# Altium project LockSafe.PrjPcb (part 1 of 2)
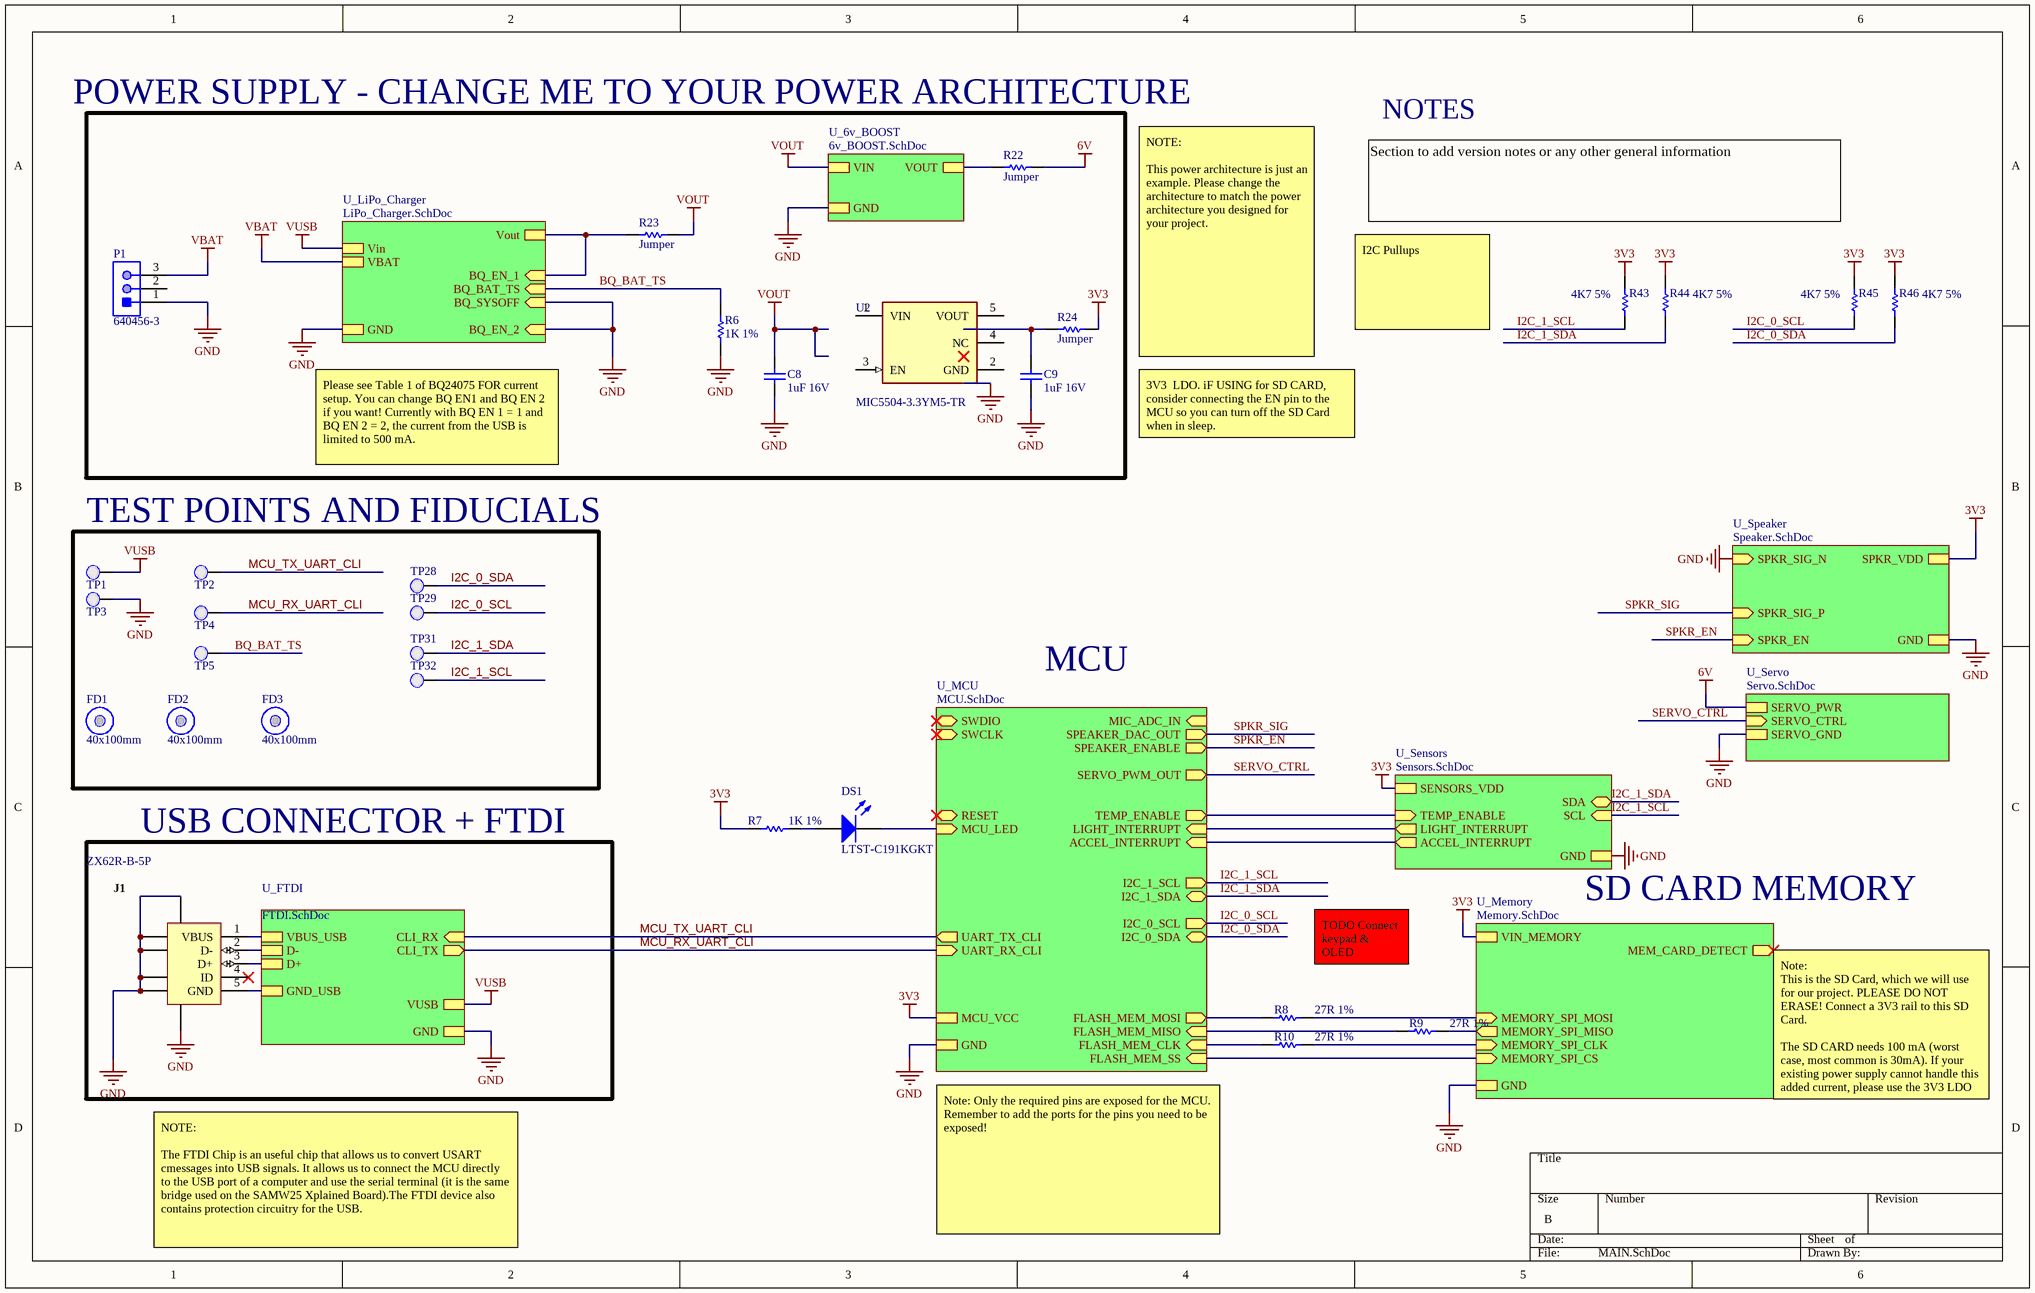
[diagram p0: MAIN.SchDoc]
14 sheets, 129 parts. Net scope: strictly hierarchical (ports join the sheet entries above them; power ports are local).
Board file: LockSafe.PcbDoc
Sheets:
  MAIN.SchDoc
    U_MCU = MCU.SchDoc
    U_6v_BOOST = 6v_BOOST.SchDoc
    U_Speaker = Speaker.SchDoc
    U_Servo = Servo.SchDoc
    U_Sensors = Sensors.SchDoc
      U_Temperature = Temperature.SchDoc
      U_Accelerometer = Accelerometer.SchDoc
      U_Light = Light.SchDoc
  3V3_BUCK.SchDoc
  6V Boost - High Current.SchDoc
  Microphone.SchDoc
  Buck6Vto3.3V.SchDoc
  LEDdriver3954.SchDoc

## Sheet MAIN.SchDoc
size B

### Parts
(Parts that share a designator on the sheet are numbered #1, #2 ... from top to bottom, then left to right.)
C8  1uF 16V  [CAPC0603(1608)100_N]
C9  1uF 16V  [CAPC0603(1608)100_N]
DS1  LTST-C191KGKT  [LITE-ON-LTST-C191KRKT-2_V]
FD1  40x100mm  [Fiducial_FT]
FD2  40x100mm  [Fiducial_FT]
FD3  40x100mm  [Fiducial_FT]
J1#1  ZX62R-B-5P  [HIRO-ZX62R-B-5P_V]
P1  640456-3  [TECO-640456-3]
R6  1K 1%  [RESC0603(1608)_N]
R7  1K 1%  [RESC0603(1608)_N]
R8  27R 1%  [RESC0603(1608)_N]
R9  27R 1%  [RESC0603(1608)_N]
R10  27R 1%  [RESC0603(1608)_N]
R22  Jumper  [RESC0805(2012)_N]
R23  Jumper  [RESC0805(2012)_N]
R24  Jumper  [RESC0805(2012)_N]
R43  4K7 5%  [RESC0402(1005)_L]
R44  4K7 5%  [RESC0402(1005)_L]
R45  4K7 5%  [RESC0402(1005)_L]
R46  4K7 5%  [RESC0402(1005)_L]
TP1  0.1" Pad  [PCBComponent]  (value not drawn)
TP2  0.1" Pad  [PCBComponent]  (value not drawn)
TP3  0.1" Pad  [PCBComponent]  (value not drawn)
TP4  0.1" Pad  [PCBComponent]  (value not drawn)
TP5  0.1" Pad  [PCBComponent]  (value not drawn)
TP28  0.1" Pad  [PCBComponent]  (value not drawn)
TP29  0.1" Pad  [PCBComponent]  (value not drawn)
TP31  0.1" Pad  [PCBComponent]  (value not drawn)
TP32  0.1" Pad  [PCBComponent]  (value not drawn)
U2  MIC5504-3.3YM5-TR  [FP-SOT23-5LD-PL-1-MFG]

### Blocks framed on the sheet
TEST POINTS AND FIDUCIALS: FD1-FD3 TP1-TP5 TP28 TP29 TP31 TP32
USB CONNECTOR + FTDI: J1#1

### Sub-sheets
U_6v_BOOST = 6v_BOOST.SchDoc: VIN, VOUT, GND
U_FTDI = FTDI.SchDoc (file not in this document): CLI_RX (in), CLI_TX (out), VUSB, GND, VBUS_USB, D-, D+, GND_USB
U_LiPo_Charger = LiPo_Charger.SchDoc (file not in this document): BQ_EN_2 (in), BQ_SYSOFF (in), BQ_EN_1 (in), BQ_BAT_TS (in), Vin, Vout, GND, VBAT
U_MCU = MCU.SchDoc: SWDIO (bidir), SWCLK (in), UART_TX_CLI (out), UART_RX_CLI (in), FLASH_MEM_SS (in), FLASH_MEM_CLK (in), FLASH_MEM_MISO (in), FLASH_MEM_MOSI (out), RESET (bidir), MCU_LED (in), MCU_VCC, GND, MIC_ADC_IN (in), SERVO_PWM_OUT (out), I2C_1_SDA (bidir), SPEAKER_DAC_OUT (out), I2C_0_SDA (bidir), I2C_1_SCL (out), I2C_0_SCL (out), SPEAKER_ENABLE (out), ACCEL_INTERRUPT (in), TEMP_ENABLE (out), LIGHT_INTERRUPT (in)
U_Memory = Memory.SchDoc (file not in this document): MEMORY_SPI_MOSI (in), MEMORY_SPI_MISO (out), MEMORY_SPI_CLK (in), MEMORY_SPI_CS (in), MEM_CARD_DETECT (out), VIN_MEMORY, GND
U_Sensors = Sensors.SchDoc: SCL (in), SENSORS_VDD, GND, SDA (bidir), TEMP_ENABLE (in), LIGHT_INTERRUPT (out), ACCEL_INTERRUPT (out)
U_Servo = Servo.SchDoc: SERVO_PWR, SERVO_GND, SERVO_CTRL (in)
U_Speaker = Speaker.SchDoc: SPKR_SIG_N (in), SPKR_EN (in), GND, SPKR_VDD, SPKR_SIG_P (in)

### Nets
3V3: R7.1 R24.2 R43.2 R44.2 R45.2 R46.2 ; sheet U_MCU/MCU_VCC, sheet U_Memory/VIN_MEMORY, sheet U_Speaker/SPKR_VDD, sheet U_Sensors/SENSORS_VDD
6V: R22.2 ; sheet U_Servo/SERVO_PWR
6V_out: R22.1 ; sheet U_6v_BOOST/VOUT
GND: C8.1 C9.1 J1#1.6(SHLD) J1#1.7(SHLD) J1#1.8(SHLD) J1#1.9(SHLD) J1#1.10(SHLD) J1#1.11(SHLD) P1.1 R6.2 TP3.1(PAD) ; sheet U_FTDI/GND, sheet U_MCU/GND, sheet U_Memory/GND, sheet U_LiPo_Charger/BQ_EN_2, sheet U_LiPo_Charger/BQ_SYSOFF, sheet U_LiPo_Charger/GND, sheet U_6v_BOOST/GND, sheet U_Speaker/SPKR_SIG_N, sheet U_Speaker/GND, sheet U_Servo/SERVO_GND, sheet U_Sensors/GND
VBAT: P1.3 ; sheet U_LiPo_Charger/VBAT
VOUT: C8.2 R23.2 ; sheet U_6v_BOOST/VIN
VUSB: TP1.1(PAD) ; sheet U_FTDI/VUSB, sheet U_LiPo_Charger/Vin
BQ_BAT_TS: R6.1 TP5.1(PAD) ; sheet U_LiPo_Charger/BQ_BAT_TS
FLASH_MEM_SPI_SS: sheet U_MCU/FLASH_MEM_SS, sheet U_Memory/MEMORY_SPI_CS
GPIO1: sheet U_MCU/TEMP_ENABLE, sheet U_Sensors/TEMP_ENABLE
I2C_0_SCL: R45.1 TP29.1(PAD) ; sheet U_MCU/I2C_0_SCL
I2C_0_SDA: R46.1 TP28.1(PAD) ; sheet U_MCU/I2C_0_SDA
I2C_1_SCL: R43.1 TP32.1(PAD) ; sheet U_MCU/I2C_1_SCL, sheet U_Sensors/SCL
I2C_1_SDA: R44.1 TP31.1(PAD) ; sheet U_MCU/I2C_1_SDA, sheet U_Sensors/SDA
INTRP0: sheet U_MCU/ACCEL_INTERRUPT, sheet U_Sensors/ACCEL_INTERRUPT
INTRP1: sheet U_MCU/LIGHT_INTERRUPT, sheet U_Sensors/LIGHT_INTERRUPT
MCU_LED: DS1.2(K) ; sheet U_MCU/MCU_LED
MCU_RX_UART_CLI: TP4.1(PAD) ; sheet U_FTDI/CLI_TX, sheet U_MCU/UART_RX_CLI
MCU_TX_UART_CLI: TP2.1(PAD) ; sheet U_FTDI/CLI_RX, sheet U_MCU/UART_TX_CLI
SERCOM1_PAD2_SPI_MISO: R9.1 ; sheet U_MCU/FLASH_MEM_MISO
SERCOM1_PAD2_SPI_MOSI: R8.1 ; sheet U_MCU/FLASH_MEM_MOSI
SERCOM1_PAD3_SPI_SCK: R10.1 ; sheet U_MCU/FLASH_MEM_CLK
SERVO_CTRL: sheet U_MCU/SERVO_PWM_OUT, sheet U_Servo/SERVO_CTRL
SPKR_EN: sheet U_MCU/SPEAKER_ENABLE, sheet U_Speaker/SPKR_EN
SPKR_SIG: sheet U_MCU/SPEAKER_DAC_OUT, sheet U_Speaker/SPKR_SIG_P
NetC9_2: C9.2 R24.1
NetDS1_1: DS1.1(A) R7.2
NetJ1#1_1: J1#1.1(VBUS) ; sheet U_FTDI/VBUS_USB
NetJ1#1_2: J1#1.2(D-) ; sheet U_FTDI/D-
NetJ1#1_3: J1#1.3(D+) ; sheet U_FTDI/D+
NetJ1#1_5: J1#1.5(GND) ; sheet U_FTDI/GND_USB
NetR8_2: R8.2 ; sheet U_Memory/MEMORY_SPI_MOSI
NetR9_2: R9.2 ; sheet U_Memory/MEMORY_SPI_MISO
NetR10_2: R10.2 ; sheet U_Memory/MEMORY_SPI_CLK
NetR23_1: R23.1 ; sheet U_LiPo_Charger/BQ_EN_1, sheet U_LiPo_Charger/Vout

Not connected (* = marked no-connect by the designer): J1#1 4(ID)*; P1 2; U2 1(VIN) 2(GND) 3(EN) 4(NC) 5(VOUT)

### Notes on the sheet
- POWER SUPPLY - CHANGE ME TO YOUR POWER ARCHITECTURE
- NOTES
- Section to add version notes or any other general information
- NOTE:
  This power architecture is just an example. Please change the architecture to match the power architecture you designed for your project.
- I2C Pullups
- 3V3  LDO. iF USING for SD CARD, consider connecting the EN pin to the MCU so you can turn off the SD Card when in sleep.
- Please see Table 1 of BQ24075 FOR current setup. You can change BQ EN1 and BQ EN 2 if you want! Currently with BQ EN 1 = 1 and BQ EN 2 = 2, the current from the USB is limited to 500 mA.
- MCU
- SD CARD MEMORY
- TODO Connect keypad & OLED
- Note:
  This is the SD Card, which we will use for our project. PLEASE DO NOT ERASE! Connect a 3V3 rail to this SD Card.
  The SD CARD needs 100 mA (worst case, most common is 30mA). If your existing power supply cannot handle this added current, please use the 3V3 LDO found in this project to power your SD Card.
- NOTE:
  The FTDI Chip is an useful chip that allows us to convert USART cmessages into USB signals. It allows us to connect the MCU directly to the USB port of a computer and use the serial terminal (it is the same bridge used on the SAMW25 Xplained Board).The FTDI device also contains protection circuitry for the USB.
- Note: Only the required pins are exposed for the MCU. Remember to add the ports for the pins you need to be exposed!

### Library data of the parts
C8 C9 = CMP-1035-02736-1: CAP 1uF 16V ±5% 0603 (1608 Metric) Thickness 1mm SMD; Case-Metric: 1608; Case-EIA: 0603; Tolerance: Â±5%; Technology: SMT; Max Thickness: 1 mm; Rated Voltage: 16 V; Value: 1uF
DS1 = CMP-2000-05198-1: Chip LED, Green, 574 nm, 40 pF, -55 to 85 degC, 2-Pin SMD, RoHS, Tape and Reel; Manufacturer: Lite-On; Rad Hardened: No; Emitting Color: YellowGreen; Product Height (mm): 0.55mm; Forward Voltage: 2.4V; Number of Elements: 1; Dominant Wave Length: 571nm; DELETED: Compliant; Viewing Angle: 130deg; High Brightness: Yes; Peak Wavelength: 574nm; Type: Uni-Color; Forward Current: 30mA; Product Length (mm): 1.6mm; Luminous Intensity: 35mcd; Test Current (It): 20mA; Chip Material: AlGaInP; Product Depth (mm): 0.8mm; Shape Type: Rectangular; Reverse Voltage: 5V; Power Dissipation: 75W; Pin Count: 2; Lens Dimensions: 1.1X0.8X0.37mm; Packaging: TapeandReel; Main Category: ChipLED; Operating Temperature Classification: Industrial; Package Type: ChipLed; Mounting: SurfaceMount; Lum Intensity: 35mcd; Operating Temp Range: -55Cto85C; Datasheet Version: Jan-07; Datasheet URL: http://download.siliconexpert.com/pdfs/2007/08/26/semi_b/manual/lot/ds/ltst-c191kgkt.pdf; Manufacturer URL: http://www.us.liteon.com/
FD1-FD3 = CMP-00174-A.4: Fiducial 40x100mm
J1#1 = CMP-0031-00001-1: Connector; USBMicro-B,Reverse type, SMT; 5 Position; Right Angle; DatasheetVersion: 08/2010; Operating Temperature: -30 to 85 degC; Mounting Technology: Surface Mount; PartNumber: ZX62R-B-5P; PackageReference: ZX62R-B-5P; ComponentLink2URL: http://www.hirose.co.jp/cataloge_hp/e24200011.pdf; ComponentLink1URL: http://www.hirose.com/â€Ž; ComponentLink2Description: Datasheet; PackageDescription: 5-Pin USB Micro-B R/A Connector; ComponentLink1Description: Manufacturer URL
P1 = CMP-2000-05418-1: Male Header, Pitch 2.54 mm, 1 x 3 Position, Height 10.03 mm, Tail Length 3.56 mm, -55 to 105 degC; Manufacturer: TE Connectivity; Agency Approvals: CSA,UL; Angle: Straight; Number of Positions: 3; Standards: RoHSCompliant,ELVCompliant,UL94V-0; Current, Rating: 5 / A; Connector Type: MTA-100; Mount Angle: Vertical; Material, Housing: Polyester; Temperature, Operating: -55to+105 / degC; Voltage, Rating: 250 / V; Color, Housing: White; Contact Centerline Spacing: 0.100 / in.; Special Features: Pinstrip; Material, Contact: CopperAlloy; Contact Termination Area Plating: Tin; Primary Type: InterconnectSystem; Pin Spacing: 0.1 / "; Brand/Series: MTA-100Series; Mounting Hole Size: 0.04 / "; Manufacturer URL: http://www.te.com/; Datasheet URL: https://datasheet.ciiva.com/16456/eng-ds-82056-mta-0608-16456886.pdf; Flammability Rating: UL94V-0; Mounting Type: PCMount; Contact Mating Area Plating: Tin; Datasheet Version: Jun-08; Number of Rows: 1; Termination: Solder; Type: PCBPlug; Length, Pin: 0.14 / "; Color: White; Contact Plating: Tin; Contact Shape: Square; Number of Contacts: 3; Size, Post: 0.025 / in.; Length, Terminal Post: 0.14 / in.; Length, Overall: 0.3 / "
R6 R7 = CMP-1012-00510-1: 1K 0.1W 1% 0603 (1608 Metric)  SMD; Case-Metric: 1608; Case-EIA: 0603; Value: 1000.00 Ohm; Technology: SMT; Tolerance: 1 %; Power: 0.1 W
R8-R10 = CMP-1012-00331-1: 27R 0.1W 1% 0603 (1608 Metric)  SMD; Case-EIA: 0603; Value: 27.00 Ohm; Case-Metric: 1608; Technology: SMT; Tolerance: 1 %; Power: 0.1 W
R22-R24 = CMP-1013-00001-1: Jumper 0805 (2012 Metric); Case-EIA: 0805; Value: 0.00 Ohm; Tolerance: None; Case-Metric: 2012; Technology: SMT; Power: None
R43-R46 = CMP-1011-00090-1: 4K7 0.063W 5% 0402 (1005 Metric)  SMD; Value: 4700.00 Ohm; Case-EIA: 0402; Case-Metric: 1005; Tolerance: 5 %; Power: 0.063 W; Technology: SMT
TP1-TP5 TP28 TP29 TP31 TP32 = 0.1" Pad-A.4
U2 = CMP-2000-07604-2: IC REG LINEAR 3.3V 300MA SOT23-5; Dropout Voltage: 380mV; Min Input Voltage: 2.5V; Max Input Voltage: 5.5V; Quiescent Current: 38uA; Operating Supply Current: 42uA; Output Type: Fixed; Power Supply Rejection Ratio (PSRR): 60dB; Accuracy: 3%; Number of Outputs: 1; Number of Pins: 5; Output Current: 300mA; Min Operating Temperature: -40°C; Max Operating Temperature: 125°C; Packaging: Tape and Reel; Mount: Surface Mount; Nominal Output Voltage: 3.3V; Output Voltage: 3.3V; REACH SVHC: No SVHC; Max Output Current: 300mA; Length: 2.9mm; Width: 1.6mm; Height: 1.1mm; Case/Package: SOT-23-5

## Sheet MCU.SchDoc
size B
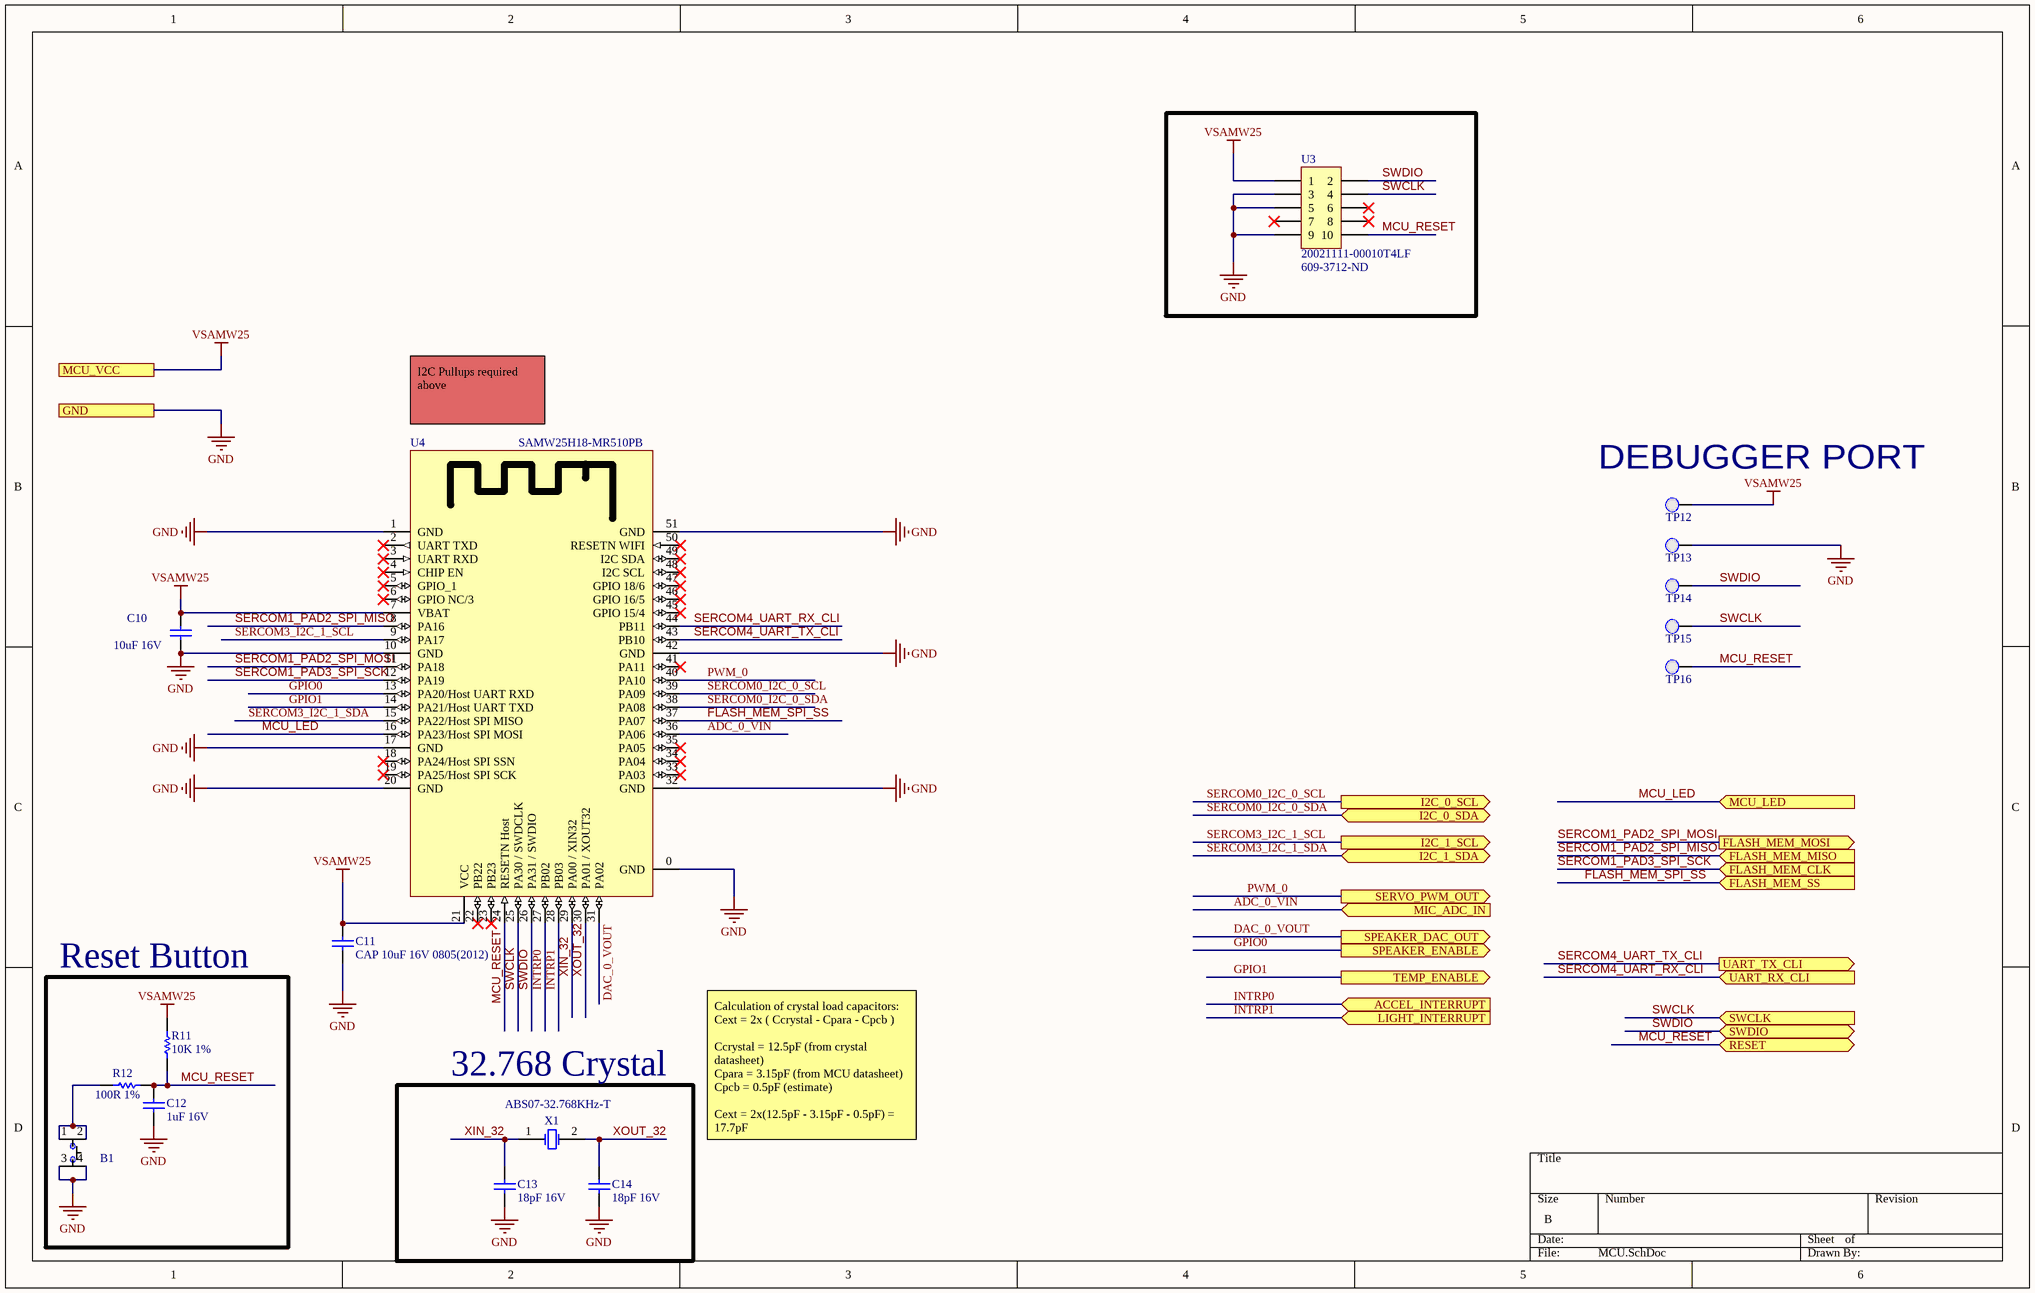
[diagram p1: MCU.SchDoc]

### Parts
B1  PTS810 SJK 250 SMTR LFS  [PTS810 SJK 250 SMTR LFS]  (value not drawn)
C10  10uF 16V  [CAPC0805(2012)145_N]
C11  CAP 10uF 16V 0805(2012)  [CAPC0805(2012)145_N]
C12  1uF 16V  [CAPC0603(1608)100_N]
C13  18pF 16V  [CAPC0603(1608)100_N]
C14  18pF 16V  [CAPC0603(1608)100_N]
R11  10K 1%  [RESC0603(1608)_N]
R12  100R 1%  [RESC0603(1608)_N]
TP12  0.1" Pad  [PCBComponent]  (value not drawn)
TP13  0.1" Pad  [PCBComponent]  (value not drawn)
TP14  0.1" Pad  [PCBComponent]  (value not drawn)
TP15  0.1" Pad  [PCBComponent]  (value not drawn)
TP16  0.1" Pad  [PCBComponent]  (value not drawn)
U3  20021111-00010T4LF  Supplier Part Number 1: 609-3712-ND  [20021111-00010T4LF]
U4  SAMW25H18-MR510PB  [SAMW25H18-MR510PB]
X1  ABS07-32.768KHz-T  [ABRA-ABS07-2_V]

### Blocks framed on the sheet
Reset Button: B1 C12 R11 R12
32.768 Crystal: C13 C14 X1

### Ports
ACCEL_INTERRUPT (in), FLASH_MEM_CLK (in), FLASH_MEM_MISO (in), FLASH_MEM_MOSI (out), FLASH_MEM_SS (in), GND, I2C_0_SCL (out), I2C_0_SDA (bidir), I2C_1_SCL (out), I2C_1_SDA (bidir), LIGHT_INTERRUPT (in), MCU_LED (in), MCU_VCC, MIC_ADC_IN (in), RESET (bidir), SERVO_PWM_OUT (out), SPEAKER_DAC_OUT (out), SPEAKER_ENABLE (out), SWCLK (in), SWDIO (bidir), TEMP_ENABLE (out), UART_RX_CLI (in), UART_TX_CLI (out)

### Nets
GND: B1.3 B1.4 C10.1 C11.1 C12.1 C13.1 C14.1 TP13.1(PAD) U3.3 U3.5 U3.9 U4.0(GND) U4.1(GND) U4.10(GND) U4.17(GND) U4.20(GND) U4.32(GND) U4.42(GND) U4.51(GND) ; port GND
VSAMW25: C10.2 C11.2 R11.2 TP12.1(PAD) U3.1 U4.7(VBAT) U4.21(VCC) ; port MCU_VCC  [project net 3V3]
ADC_0_VIN: U4.36(PA06) ; port MIC_ADC_IN
DAC_0_VOUT: U4.31(PA02) ; port SPEAKER_DAC_OUT  [project net SPKR_SIG]
FLASH_MEM_SPI_SS: U4.37(PA07) ; port FLASH_MEM_SS
GPIO0: U4.13(PA20/Host_UART_RXD) ; port SPEAKER_ENABLE  [project net SPKR_EN]
GPIO1: U4.14(PA21/Host_UART_TXD) ; port TEMP_ENABLE
INTRP0: U4.27(PB02) ; port ACCEL_INTERRUPT
INTRP1: U4.28(PB03) ; port LIGHT_INTERRUPT
MCU_LED: U4.16(PA23/Host_SPI_MOSI) ; port MCU_LED
MCU_RESET: C12.2 R11.1 R12.2 TP16.1(PAD) U3.10 U4.24(RESETN_Host) ; port RESET
PWM_0: U4.40(PA10) ; port SERVO_PWM_OUT  [project net SERVO_CTRL]
SERCOM0_I2C_0_SCL: U4.39(PA09) ; port I2C_0_SCL  [project net I2C_0_SCL]
SERCOM0_I2C_0_SDA: U4.38(PA08) ; port I2C_0_SDA  [project net I2C_0_SDA]
SERCOM1_PAD2_SPI_MISO: U4.8(PA16) ; port FLASH_MEM_MISO
SERCOM1_PAD2_SPI_MOSI: U4.11(PA18) ; port FLASH_MEM_MOSI
SERCOM1_PAD3_SPI_SCK: U4.12(PA19) ; port FLASH_MEM_CLK
SERCOM3_I2C_1_SCL: U4.9(PA17) ; port I2C_1_SCL  [project net I2C_1_SCL]
SERCOM3_I2C_1_SDA: U4.15(PA22/Host_SPI_MISO) ; port I2C_1_SDA  [project net I2C_1_SDA]
SERCOM4_UART_RX_CLI: U4.44(PB11) ; port UART_RX_CLI  [project net MCU_RX_UART_CLI]
SERCOM4_UART_TX_CLI: U4.43(PB10) ; port UART_TX_CLI  [project net MCU_TX_UART_CLI]
SWCLK: TP15.1(PAD) U3.4 U4.25(PA30_/_SWDCLK) ; port SWCLK
SWDIO: TP14.1(PAD) U3.2 U4.26(PA31_/_SWDIO) ; port SWDIO
XIN_32: C13.2 U4.29(PA00_/_XIN32) X1.1(X1)
XOUT_32: C14.2 U4.30(PA01_/_XOUT32) X1.2(X2)
NetB1_1: B1.1 B1.2 R12.1

Not connected (* = marked no-connect by the designer): U3 6* 7* 8*; U4 2(UART_TXD)* 3(UART_RXD)* 4(CHIP_EN)* 5(GPIO_1)* 6(GPIO_NC/3)* 18(PA24/Host_SPI_SSN)* 19(PA25/Host_SPI_SCK)* 22(PB22)* 23(PB23)* 33(PA03)* 34(PA04)* 35(PA05)* 41(PA11)* 45(GPIO_15/4)* 46(GPIO_16/5)* 47(GPIO_18/6)* 48(I2C_SCL)* 49(I2C_SDA)* 50(RESETN_WIFI)*

### Notes on the sheet
- I2C Pullups required above
- (near TP12) DEBUGGER PORT
- Calculation of crystal load capacitors:
  Cext = 2x ( Ccrystal - Cpara - Cpcb )
  Ccrystal = 12.5pF (from crystal datasheet)
  Cpara = 3.15pF (from MCU datasheet)
  Cpcb = 0.5pF (estimate)
  Cext = 2x(12.5pF - 3.15pF - 0.5pF) = 17.7pF

### Library data of the parts
B1 = PTS810 SJK 250 SMTR LFS: SWITCH TACTILE SPST-NO 0.05A 16V Tactile Switch SPST-NO Top Actuated Surface Mount; Manufacturer: ITT /  C&K Components; Part # Aliases: Y97LT25B5DBFP; Operating Force: 2.6 N; Actuator: Oval; Current Rating: 50 mA; Voltage Rating DC: 16 VDC; Contact Form: SPST; Switch Function: OFF - (ON); Mounting Direction: Straight; Stem Height: 2.5 mm; Brand: C&K Components; Travel: 0.15 mm; Manufacturer Part Number: PTS810SJK250SMTRLFS; Product Category: Tactile Switches; RoHS: Details; Termination Style: J Form Lead; Mounting Style: SMD/SMT; Color: White; Packaging: Reel; Contact Plating: Silver; Operating Temperature Range: - 40 C to + 85 C; Series: PTS810; Factory Pack Quantity: 2900; ComponentLink1URL: https://datasheet.ciiva.com/18514/pts810-4mar13-18514061.pdf; ComponentLink1Description: https://datasheet.ciiva.com/18514/pts810-4mar13-18514061.pdf; ComponentLink2URL: https://datasheet.ciiva.com/18514/pts810-4mar13-18514062.pdf; ComponentLink2Description: https://datasheet.ciiva.com/18514/pts810-4mar13-18514062.pdf; ComponentLink3URL: https://datasheet.ciiva.com/18514/pts810-4mar13-18514063.pdf; ComponentLink3Description: https://datasheet.ciiva.com/18514/pts810-4mar13-18514063.pdf; Supplier 1: Digi-Key; Supplier Part Number 1: CKN10503CT-ND
C10 C11 = CMP-1036-04927-1: CAP 10uF 16V ±10% 0805 (2012 Metric) Thickness 1.45mm SMD; Case-EIA: 0805; Tolerance: Â±10%; Case-Metric: 2012; Rated Voltage: 16 V; Technology: SMT; Value: 10uF; Max Thickness: 1.45 mm
C12 = CMP-1035-02736-1: as C8 on sheet MAIN; Technology: SMT; Max Thickness: 1 mm; Rated Voltage: 16 V; Value: 1uF
C13 C14 = CMP-1035-00738-1: CAP 18pF 16V ±5% 0603 (1608 Metric) Thickness 1mm SMD; Tolerance: Â±5%; Case-EIA: 0603; Case-Metric: 1608; Max Thickness: 1 mm; Rated Voltage: 16 V; Value: 18pF; Technology: SMT
R11 = CMP-1012-00623-1: 10K 0.1W 1% 0603 (1608 Metric)  SMD; Value: 10000.00 Ohm; Case-EIA: 0603; Case-Metric: 1608; Power: 0.1 W; Tolerance: 1 %; Technology: SMT
R12 = CMP-1012-00397-1: 100R 0.1W 1% 0603 (1608 Metric)  SMD; Value: 100.00 Ohm; Case-EIA: 0603; Case-Metric: 1608; Technology: SMT; Tolerance: 1 %; Power: 0.1 W
TP12-TP16 = 0.1" Pad-A.4
U3 = 20021111-00010T4LF: CONN HEADER 10POS UNSHD VERT T/H; Manufacturer: Amphenol / FCI; Stack Height: 2.5 mm; Number of Positions / Contacts: 10; Brand: FCI; Pitch: 1.27 mm; Mounting Angle: Vertical; Current Rating: 10 A; Mating Post Length: 3.05 mm; Voltage Rating: 125 V; Manufacturer Part Number: 20021111-00010T4LF; Mounting Style: Through Hole; Product Category: Headers & Wire Housings; RoHS: Details; Series: Minitek; Product Type: Headers; Type: Unshrouded; Number of Positions: 10; Number of Rows: 2; Contact Plating: Gold; Housing Material: Plastic; Termination Style: Through Hole; Contact Material: Nickel; Packaging: Tube; Factory Pack Quantity: 93; Termination Post Length: 2.3 mm; ComponentLink1URL: https://datasheet.ciiva.com/1433/1079612-1433267.pdf; ComponentLink1Description: https://datasheet.ciiva.com/1433/1079612-1433267.pdf; ComponentLink2URL: https://datasheet.ciiva.com/409/20021111-409158.pdf; ComponentLink2Description: https://datasheet.ciiva.com/409/20021111-409158.pdf; ComponentLink3URL: https://datasheet.ciiva.com/5131/20021111-5131386.pdf; ComponentLink3Description: https://datasheet.ciiva.com/5131/20021111-5131386.pdf; ComponentLink4URL: https://datasheet.ciiva.com/9465/20021111-9465402.pdf; ComponentLink4Description: https://datasheet.ciiva.com/9465/20021111-9465402.pdf; Supplier 1: Digi-Key
U4 = SAMW25H18-MR510PB: RF TXRX MODULE WIFI TRACE ANT; Manufacturer: Atmel; Manufacturer Part Number: ATSAMW25H18-MR510PB; Protocol: 802.11b/g/n; Frequency: 2.4GHz; Data Rate: 65Mbps; Power - Output: 17dBm; Sensitivity: -95.5dBm; Serial Interfaces: SPI, UART; Antenna Type: Integrated, Trace; Memory Size: 256kB Flash, 32kB SRAM; Voltage - Supply: 2.7 V ~ 4.2 V; Category: RF/IF and RFID; Family: RF Transceiver Modules; Series: Xplained Pro; Packaging: Tray; RF Family/Standard: WiFi; Modulation: -; Current - Receiving: -; Current - Transmitting: -; Mounting Type: Surface Mount; Operating Temperature: -40°C ~ 85°C; Package / Case: Module; ComponentLink1URL: http://www.atmel.com/devices/ATSAMW25.aspx; ComponentLink1Description: http://www.atmel.com/devices/ATSAMW25.aspx; ComponentLink2URL: http://www.farnell.com/datasheets/1965115.pdf; ComponentLink2Description: http://www.farnell.com/datasheets/1965115.pdf; Supplier 1: Digikey; Stock 1: 120; Pricing 1: 1=19.14 (USD); Supplier Part Number 1: ATSAMW25H18-MR510PB-ND
X1 = CMP-0447-00001-2: Crystal, 32.768 kHz, 12.5 pF, -40 to 85 degC, SMD Low Profile 3.2 x 1.5 x 0.9 mm, Tape and Reel; Manufacturer: Abracon; Q Value (Type): 30000; Operation Mode: Flexural Mode (Tuning Fork); Shunt Capacitance (C0): 0.9 to 1.2 pF; Load Capacitance (CL): 12.5 pF; Frequency Tolerance @+25degC: +/- 20 ppm; Drive Level (Type): 0.1 uW; Equivalent Series Resistance (R1): 70 Kohm; Insulation Resistance (Min): 500 Mohm; ComponentLink3URL: http://www.abracon.com/Resonators/ABS07.pdf; PackageDescription: 2-Pin Hand Drawn, Body 3.2x1.5mm, Pitch 2.5mm; Operating Temperature: -40 to 85 degC; ComponentLink2URL: http://www.abracon.com/Resonators/ABS07.pdf; PackageReference: ABS07-2; ComponentLink3Description: Package Specification; ComponentLink1Description: Manufacturer URL; DatasheetVersion: 04.03.13; Mounting Technology: Surface Mount; ComponentLink2Description: Datasheet; ComponentLink1URL: http://www.abracon.com/; PartNumber: ABS07-32.768KHz-T; Packing: Tape and Reel; Frequency: 32.768 kHz

## Sheet 6v_BOOST.SchDoc
size A
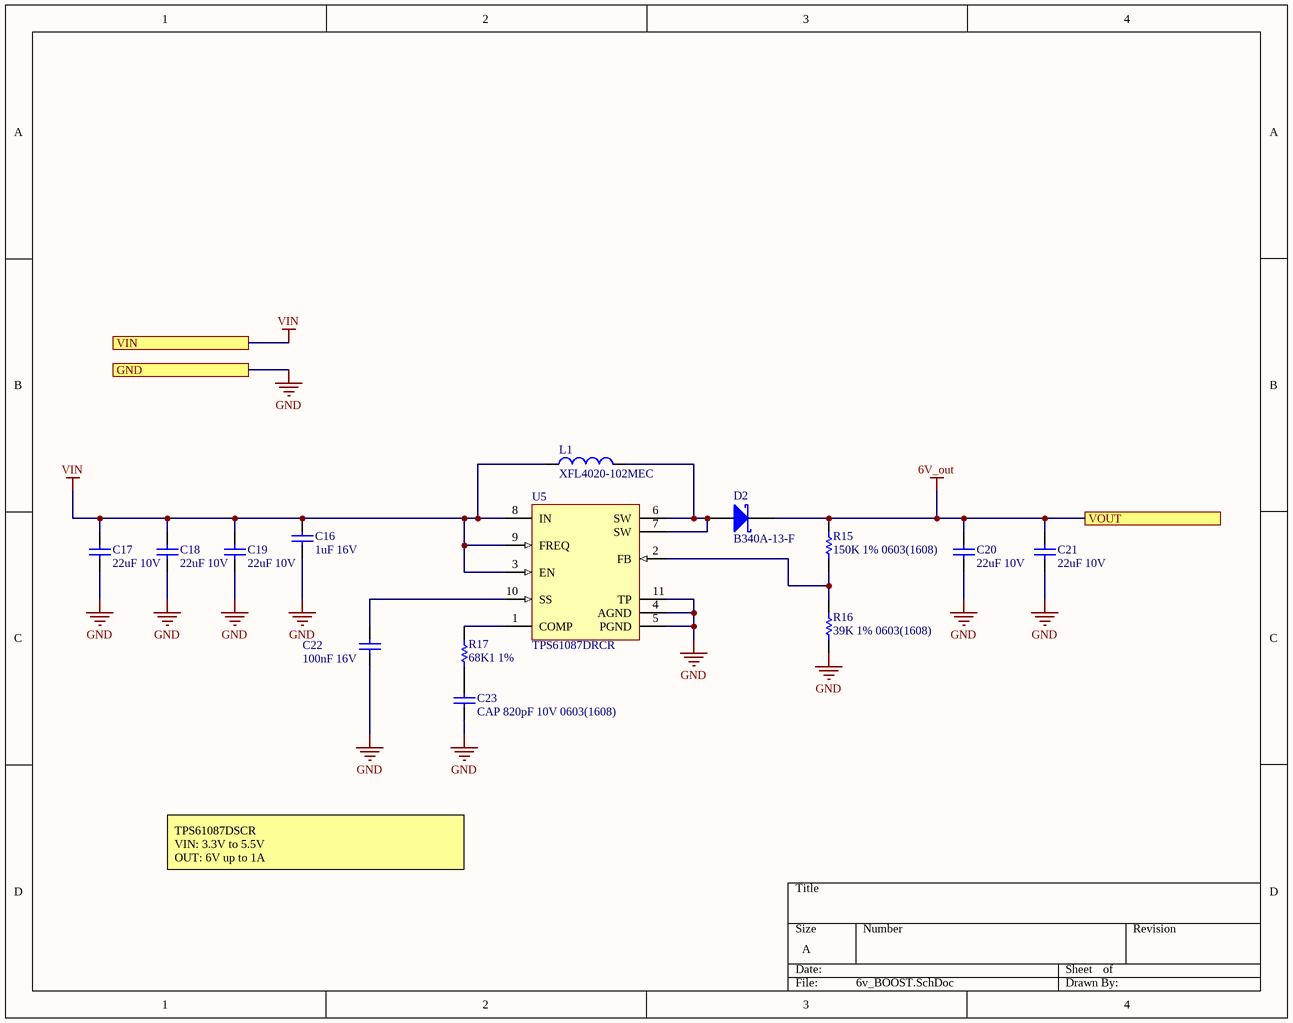
[diagram p2: 6v_BOOST.SchDoc]

### Parts
(Parts that share a designator on the sheet are numbered #1, #2 ... from top to bottom, then left to right.)
C16  1uF 16V  [CAPC0603(1608)100_N]
C17  22uF 10V  [CAPC0805(2012)145_N]
C18  22uF 10V  [CAPC0805(2012)145_N]
C19  22uF 10V  [CAPC0805(2012)145_N]
C20  22uF 10V  [CAPC0805(2012)145_N]
C21  22uF 10V  [CAPC0805(2012)145_N]
C22  100nF 16V  [CAPC0603(1608)100_N]
C23  CAP 820pF 10V 0603(1608)  [CAPC0603(1608)100_N]
D2  B340A-13-F  [DIOD-SMA-2_V]
L1#1  XFL4020-102MEC  [COIL-XFL4020_V]
R15  150K 1% 0603(1608)  [RESC0603(1608)_N]
R16  39K 1% 0603(1608)  [RESC0603(1608)_N]
R17  68K1 1%  [RESC0603(1608)_N]
U5  TPS61087DRCR  [DRC0010J_V]

### Ports
GND, VIN, VOUT

### Nets
6V_out: C20.2 C21.2 D2.2(K) R15.2 ; port VOUT
GND: C16.1 C17.1 C18.1 C19.1 C20.1 C21.1 C22.1 C23.1 R16.1 U5.4(AGND) U5.5(PGND) U5.11(TP) ; port GND
VIN: C16.2 C17.2 C18.2 C19.2 L1#1.1 U5.3(EN) U5.8(IN) U5.9(FREQ) ; port VIN  [project net VOUT]
NetC22_2: C22.2 U5.10(SS)
NetC23_2: C23.2 R17.1
NetD2_1: D2.1(A) L1#1.2 U5.6(SW) U5.7(SW)
NetR15_1: R15.1 R16.2 U5.2(FB)
NetR17_2: R17.2 U5.1(COMP)

### Notes on the sheet
- TPS61087DSCR
  VIN: 3.3V to 5.5V
  OUT: 6V up to 1A

### Library data of the parts
C16 = CMP-1035-02736-1: as C8 on sheet MAIN; Technology: SMT; Max Thickness: 1 mm; Rated Voltage: 16 V; Value: 1uF
C17-C21 = CMP-1036-04943-1: CAP 22uF 10V ±20% 0805 (2012 Metric) Thickness 1.45mm SMD; Case-Metric: 2012; Case-EIA: 0805; Tolerance: Â±20%; Rated Voltage: 10 V; Max Thickness: 1.45 mm; Technology: SMT; Value: 22uF
C22 = CMP-1035-02584-1: CAP 100nF 16V ±10% 0603 (1608 Metric) Thickness 1mm SMD; Tolerance: Â±10%; Case-EIA: 0603; Case-Metric: 1608; Technology: SMT; Max Thickness: 1 mm; Value: 100nF; Rated Voltage: 16 V
C23 = CMP-1035-01821-1: CAP 820pF 10V ±10% 0603 (1608 Metric) Thickness 1mm SMD; Case-EIA: 0603; Case-Metric: 1608; Tolerance: Â±10%; Max Thickness: 1 mm; Rated Voltage: 10 V; Technology: SMT; Value: 820pF
D2 = CMP-1667-00003-1: Surface Mount Schottky Barrier Rectifier, 40 V, 3 A, -55 to 150 degC, 2-Pin SMA, RoHS, Tape and Reel; Forward Current: 3 A; Forward Voltage: 500 mV; Max Surge Current: 80 A; Peak Reverse Current: 500 uA; Elements: 1; Mounting Technology: Surface Mount; ComponentLink1URL: http://www.diodes.com/; PackageDescription: 2-Pin Surface Mounted Assembly, Body 4.3 x 2.605 mm, Height 2.4 mm; Min Operating Temperature: -55 degC; Mount: Surface Mount; Pins: 2; ComponentLink2URL: http://www.diodes.com/_files/datasheets/ds30891.pdf; PackageReference: SMA-2; Max Operating Temperature: 125 degC; Radiation Hardening: No; Length: 4.6 mm; RoHSCompliant: true; ComponentLink1Description: Manufacturer URL; Height: 2.1 mm; ComponentLink2Description: Datasheet; Packaging: Tape and Reel; Package Quantity: 5000; Case\Package: SMA; DatasheetVersion: Rev. 17 - 2, 09/2015; REACH SVHC: No SVHC; Width: 2.92 mm
L1#1 = CMP-2000-07423-1: Shielded Power Inductor, 1 uH, 64 MHz, -40 to 125 degC, 2-Pin SMD, RoHS, Tape and Reel; Manufacturer: Coilcraft; Case Width: 4.3mm; Case Height: 2.1mm; Maximum DC Current: 11A; Core Material: Composite; Test Frequency: 100kHz; Tolerance: 20%; Maximum DC Resistance: 11.9mOhms; Inductance: 1uH; Self Resonant Frequency: 64MHz; RoHS: Details; Series: XFL4020; Case Length: 4.3mm; Package Reference: XFL4020; Dimensions: 4.3mmWx4.3mmLx2.1mmH; Product: PowerInductors; Datasheet Version: 07/2012; Manufacturer URL: http://www.coilcraft.com/; Termination Style: SMD/SMT; Mounting Technology: SurfaceMount; Operating Temperature Range: -40Cto+125C; Package Description: 2-Pin Surface Mount Device, Body 4 x 4 mm, Pitch 2.37 mm; Shielding: Shielded; Packaging: Reel; Datasheet URL: http://www.mouser.com/ds/2/597/xfl4020-270756.pdf
R15 = CMP-1012-00754-1: 150K 0.1W 1% 0603 (1608 Metric)  SMD; Case-EIA: 0603; Case-Metric: 1608; Value: 150000.00 Ohm; Tolerance: 1 %; Power: 0.1 W; Technology: SMT
R16 = CMP-1012-00689-1: 39K 0.1W 1% 0603 (1608 Metric)  SMD; Case-Metric: 1608; Case-EIA: 0603; Value: 39000.00 Ohm; Technology: SMT; Tolerance: 1 %; Power: 0.1 W
R17 = CMP-1012-00718-1: 68K1 0.1W 1% 0603 (1608 Metric)  SMD; Case-EIA: 0603; Case-Metric: 1608; Value: 68100.00 Ohm; Technology: SMT; Power: 0.1 W; Tolerance: 1 %
U5 = CMP-0343-00035-2: Boost Voltage Converter with 2.5 to 6 V Input and 3 to 18.5 V Output, -40 to 85 degC, 10-Pin SON (DRC), Green (RoHS & no Sb/Br); Manufacturer: Texas Instruments; Vout(Max)(V): 18.5; Switching Frequency(Typ)(kHz): 650, 1200; SubFamily: Step-Up Regulator; Regulated Outputs(#): 1; Vout(Min)(V): 3; Vin(Min)(V): 2.5; Vin(Max)(V): 6; PartNumber: TPS61087DRCR; ComponentLink1Description: Datasheet; Mounting Technology: Surface Mount; Eco-Plan: Green (RoHS & no Sb/Br); Topology: Boost; PackageVersion: revL, Sep-2011; DatasheetVersion: SLVS821B; ComponentLink1URL: http://www.ti.com/general/docs/lit/getliterature.tsp?genericPartNumber=TPS61087&fileType=pdf; ComponentLink2URL: http://www.ti.com/litv/pdf/mpds117k; ComponentLink2Description: Package Specification; PackageDescription: 10-Pin Plastic Small Outline No-Lead, 3 x 3 x 1 mm Body, 0.5 mm Pitch, Exposed Pad; PackageReference: DRC0010J

## Sheet Speaker.SchDoc
size A
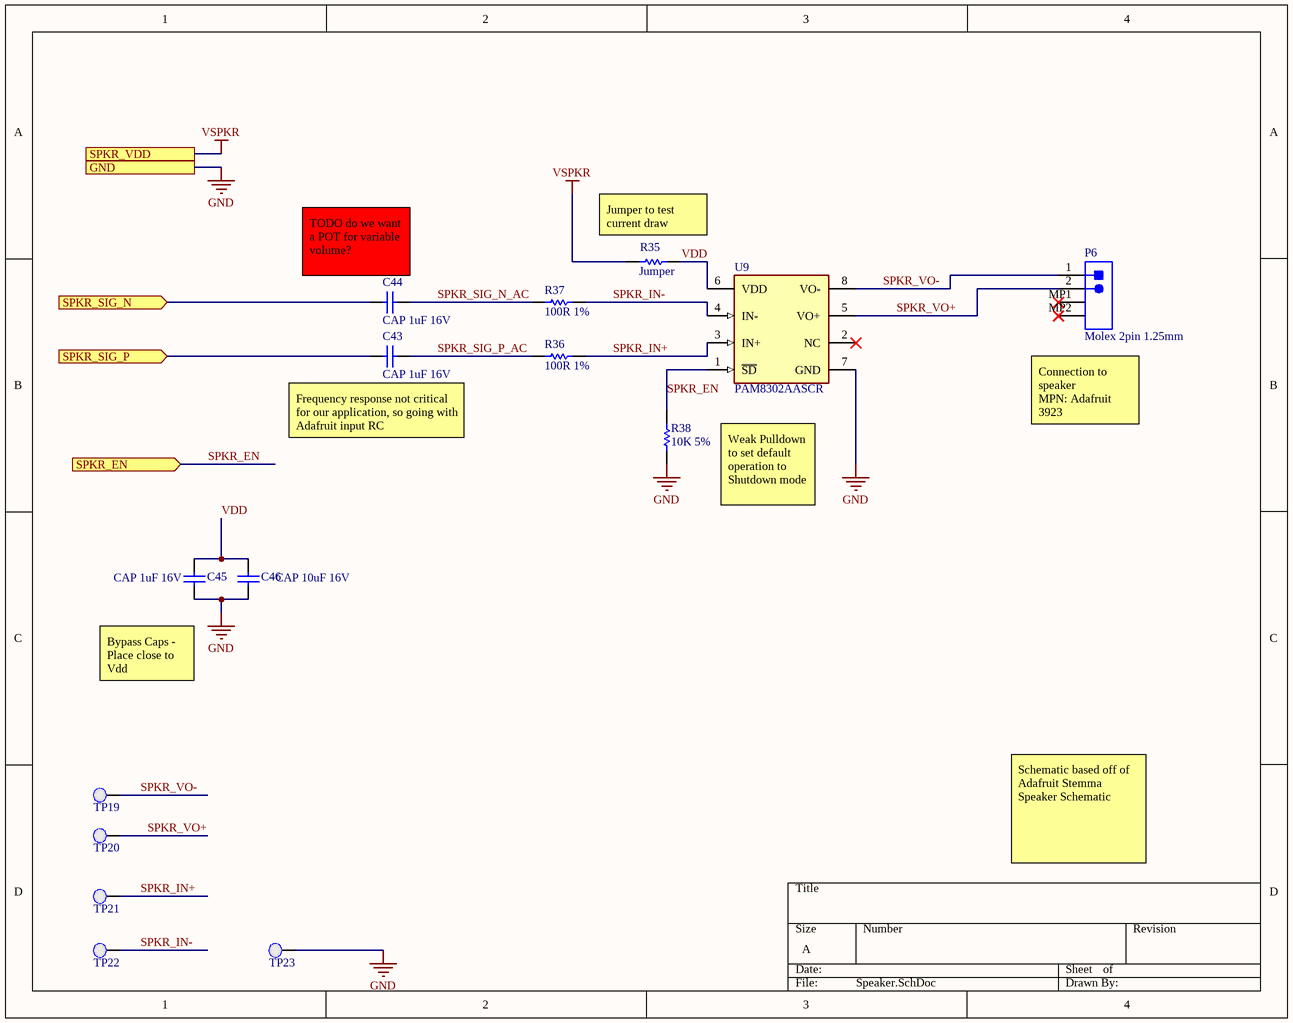
[diagram p3: Speaker.SchDoc]

### Parts
C43  CAP 1uF 16V  [CAPC0402(1005)60_M]
C44  CAP 1uF 16V  [CAPC0402(1005)60_M]
C45  CAP 1uF 16V  [CAPC0402(1005)60_M]
C46  CAP 10uF 16V  [CAPC0805(2012)145_L]
P6  Molex 2pin 1.25mm  [MOLX-53261-0271_V]
R35  Jumper  [RESC0805(2012)_N]
R36  100R 1%  [RESC0402(1005)_N]
R37  100R 1%  [RESC0402(1005)_N]
R38  10K 5%  [RESC0402(1005)_N]
TP19  0.1" Pad  [PCBComponent]  (value not drawn)
TP20  0.1" Pad  [PCBComponent]  (value not drawn)
TP21  0.1" Pad  [PCBComponent]  (value not drawn)
TP22  0.1" Pad  [PCBComponent]  (value not drawn)
TP23  0.1" Pad  [PCBComponent]  (value not drawn)
U9  PAM8302AASCR  [FP-MSOP-8-MFG]

### Ports
GND, SPKR_EN (in), SPKR_SIG_N (in), SPKR_SIG_P (in), SPKR_VDD

### Nets
GND: C44.2 C45.1 C46.1 R38.1 TP23.1(PAD) U9.7(GND) ; port SPKR_SIG_N, port GND
VSPKR: R35.1 ; port SPKR_VDD  [project net 3V3]
SPKR_EN: R38.2 U9.1(~{SD}) ; port SPKR_EN
SPKR_IN+: R36.2 TP21.1(PAD) U9.3(IN+)
SPKR_IN-: R37.2 TP22.1(PAD) U9.4(IN-)
SPKR_SIG: C43.2 ; port SPKR_SIG_P
SPKR_SIG_N_AC: C44.1 R37.1
SPKR_SIG_P_AC: C43.1 R36.1
SPKR_VO+: P6.2 TP20.1(PAD) U9.5(VO+)
SPKR_VO-: P6.1 TP19.1(PAD) U9.8(VO-)
VDD: C45.2 C46.2 R35.2 U9.6(VDD)

Not connected (* = marked no-connect by the designer): P6 MP1* MP2*; U9 2(NC)*

### Notes on the sheet
- (near R35) Jumper to test current draw
- (near C44) TODO do we want a POT for variable volume?
- (near C43) Frequency response not critical for our application, so going with Adafruit input RC
- (near P6) Connection to  speaker
  MPN: Adafruit 3923
- Weak Pulldown to set default operation to Shutdown mode
- (near C45) Bypass Caps - Place close to Vdd
- Schematic based off of Adafruit Stemma Speaker Schematic

### Library data of the parts
C43-C45 = CMP-1034-02119-1: CAP 1uF 16V ±10% 0402 (1005 Metric) Thickness 0.6mm SMD; Case-EIA: 0402; Tolerance: Â±10%; Case-Metric: 1005; Technology: SMT; Rated Voltage: 16 V; Max Thickness: 0.6 mm; Value: 1uF
C46 = CMP-1036-04927-1: as C10 on sheet MCU; Rated Voltage: 16 V; Technology: SMT; Value: 10uF; Max Thickness: 1.45 mm
P6 = CMP-2000-05633-1: PicoBlade(TM) Header, Right Angle, -40 to 85 degC, 2-Pin SMD, RoHS, Tape and Reel; Current - Max: 1A; Voltage Rating: 125V; Number of Positions: 2; Package Version: Rev. H, 11/2014; Factory Pack Quantity: 1000; Datasheet URL: http://www.molex.com/webdocs/datasheets/pdf/en-us/0532610271_PCB_HEADERS.pdf; Datasheet Version: 03/2016; Housing Material: Thermoplastic; RoHS: Details; Product Type: Headers; Number of Rows: 1; Termination Style: SMD; Brand: Molex; Mounting Technology: SurfaceMount; Number of Positions / Contacts: 2; Package URL: http://www.molex.com/pdm_docs/sd/532610271_sd.pdf; Mounting Angle: Right; Mounting Style: SMD/SMT; Manufacturer: Molex; Product Category: 1.25mmConnectors; Tradename: PicoBlade; Voltage - Max: 125V; Manufacturer URL: http://www.molex.com/; Series: 53261; Package Description: 2-Leads Header, Pitch 1.25 mm, Mated Height 3.4 mm; Package Reference: 53261-0271; Current Rating: 1A; Contact Plating: Tin; Pitch: 1.25mm; Contact Material: PhosphorBronze; Type: Shrouded; Packaging: Reel
R35 = CMP-1013-00001-1: as R22 on sheet MAIN; Technology: SMT; Power: None
R36 R37 = CMP-1011-00397-1: 100R 0.063W 1% 0402 (1005 Metric)  SMD; Case-EIA: 0402; Case-Metric: 1005; Value: 100.00 Ohm; Technology: SMT; Tolerance: 1 %; Power: 0.063 W
R38 = CMP-1011-00098-1: 10K 0.063W 5% 0402 (1005 Metric)  SMD; Case-Metric: 1005; Value: 10000.00 Ohm; Case-EIA: 0402; Technology: SMT; Tolerance: 5 %; Power: 0.063 W
TP19-TP23 = 0.1" Pad-A.4
U9 = CMP-12733-000002-1: IC AMP CLASS D MONO 2.5W 8MSOP; Manufacturer: Diodes Inc.; Nominal Supply Current: 4mA; Number Of Channels: 1; Max Junction Temp: +125°C; Min Supply Voltage: 2V; Power At Speaker R: 2.5W @ 4Ω; Max Supply Voltage: 5.5V; Voltage Gain: 24dB; Standoff Height: 0.05mm; Manufacturer Part Number: PAM8302AASCR; ComponentLink2URL: https://www.diodes.com/assets/Datasheets/PAM8302A.pdf; Mouser Description: Audio Amplifiers 2.5W MONO FILTERLESS CLASS-D AUDIO AMP; ComponentLink2Description: Datasheet; Temperature: -40°C to +85°C; Automotive: No; Footprint Url: https://www.diodes.com/assets/Package-Files/MSOP-8.pdf; Device Class L1: Integrated Circuits (ICs); Temperature Range Low: -40°C; Temperature Range High: +85°C; Lead Free: Yes; Package: MSOP-8; Height: 1.1mm; Category: IC; Ipc Land Pattern Name: SOP65P490X110-8; Octopart: https://octopart.com/pam8302aascr-diodes+inc.-29030473; RoHS: TRUE; Device Class L3: Amplifiers - Audio; Device Class L2: Linear ICs; Digikey Description: IC AMP CLASS D MONO 2.5W 8MSOP

## Sheet Servo.SchDoc
size A
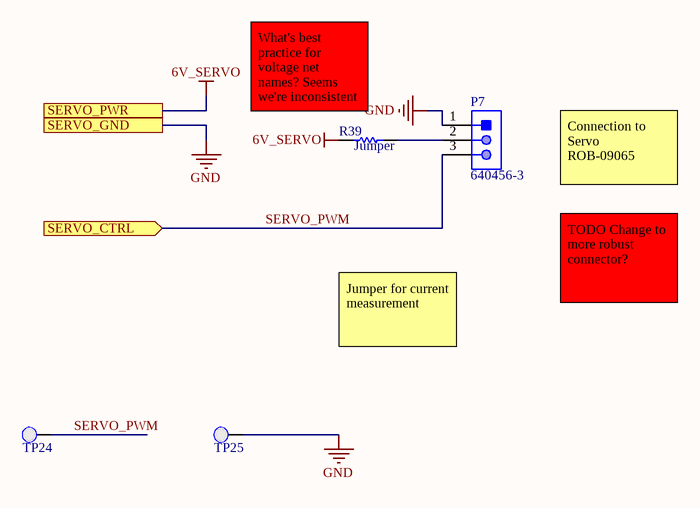
[diagram p4: Servo.SchDoc]

### Parts
P7  640456-3  [TECO-640456-3]
R39  Jumper  [RESC0603(1608)_N]
TP24  0.1" Pad  [PCBComponent]  (value not drawn)
TP25  0.1" Pad  [PCBComponent]  (value not drawn)

### Ports
SERVO_CTRL (in), SERVO_GND, SERVO_PWR

### Nets
6V_SERVO: R39.1 ; port SERVO_PWR  [project net 6V]
GND: P7.1 TP25.1(PAD) ; port SERVO_GND
SERVO_PWM: P7.3 TP24.1(PAD) ; port SERVO_CTRL  [project net SERVO_CTRL]
NetP7_2: P7.2 R39.2

### Notes on the sheet
- (near R39) What's best practice for voltage net names? Seems we're inconsistent
- Connection to Servo
  ROB-09065
- Jumper for current measurement
- TODO Change to more robust connector?

### Library data of the parts
P7 = CMP-2000-05418-1: as P1 on sheet MAIN; Manufacturer URL: http://www.te.com/; Datasheet URL: https://datasheet.ciiva.com/16456/eng-ds-82056-mta-0608-16456886.pdf; Flammability Rating: UL94V-0; Mounting Type: PCMount; Contact Mating Area Plating: Tin; Datasheet Version: Jun-08; Number of Rows: 1; Termination: Solder; Type: PCBPlug; Length, Pin: 0.14 / "; Color: White; Contact Plating: Tin; Contact Shape: Square; Number of Contacts: 3; Size, Post: 0.025 / in.; Length, Terminal Post: 0.14 / in.; Length, Overall: 0.3 / "
R39 = CMP-1012-00001-1: Jumper 0603 (1608 Metric); Case-Metric: 1608; Value: 0.00 Ohm; Power: None; Case-EIA: 0603; Technology: SMT; Tolerance: None
TP24 TP25 = 0.1" Pad-A.4

## Sheet Sensors.SchDoc
size A
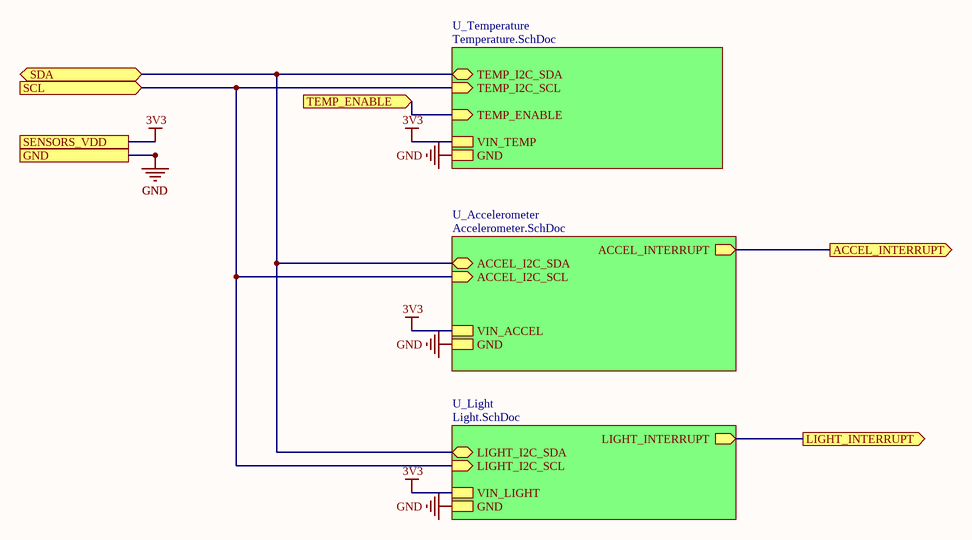
[diagram p5: Sensors.SchDoc]

### Sub-sheets
U_Accelerometer = Accelerometer.SchDoc: VIN_ACCEL, ACCEL_I2C_SDA (bidir), ACCEL_I2C_SCL (in), ACCEL_INTERRUPT (out), GND
U_Light = Light.SchDoc: VIN_LIGHT, LIGHT_I2C_SDA (bidir), LIGHT_I2C_SCL (in), GND, LIGHT_INTERRUPT (out)
U_Temperature = Temperature.SchDoc: VIN_TEMP, TEMP_I2C_SDA (bidir), TEMP_I2C_SCL (in), TEMP_ENABLE (in), GND

### Ports
ACCEL_INTERRUPT (out), GND, LIGHT_INTERRUPT (out), SCL (in), SDA (bidir), SENSORS_VDD, TEMP_ENABLE (in)

### Nets
 3V3: port SENSORS_VDD, sheet U_Temperature/VIN_TEMP, sheet U_Accelerometer/VIN_ACCEL, sheet U_Light/VIN_LIGHT  [project net 3V3]
GND: port GND, sheet U_Temperature/GND, sheet U_Accelerometer/GND, sheet U_Light/GND
GPIO1: port TEMP_ENABLE, sheet U_Temperature/TEMP_ENABLE
I2C_1_SCL: port SCL, sheet U_Temperature/TEMP_I2C_SCL, sheet U_Accelerometer/ACCEL_I2C_SCL, sheet U_Light/LIGHT_I2C_SCL
I2C_1_SDA: port SDA, sheet U_Temperature/TEMP_I2C_SDA, sheet U_Accelerometer/ACCEL_I2C_SDA, sheet U_Light/LIGHT_I2C_SDA
INTRP0: port ACCEL_INTERRUPT, sheet U_Accelerometer/ACCEL_INTERRUPT
INTRP1: port LIGHT_INTERRUPT, sheet U_Light/LIGHT_INTERRUPT

## Sheet Temperature.SchDoc
size A
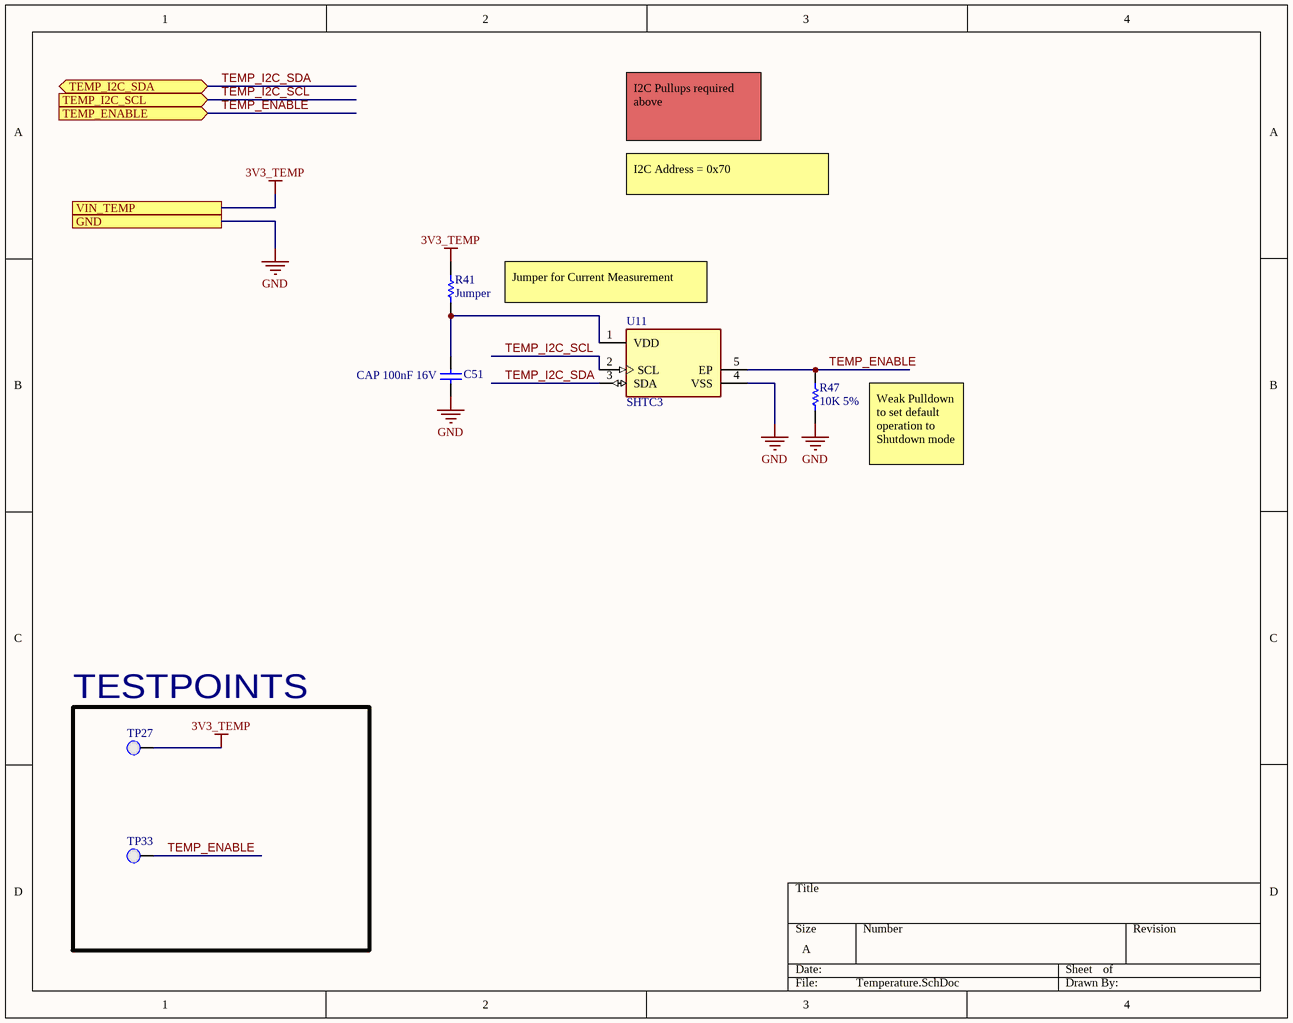
[diagram p6: Temperature.SchDoc]

### Parts
C51  CAP 100nF 16V  [CAPC0402(1005)60_M]
R41  Jumper  [RESC0805(2012)_N]
R47  10K 5%  [RESC0402(1005)_N]
TP27  0.1" Pad  [PCBComponent]  (value not drawn)
TP33  0.1" Pad  [PCBComponent]  (value not drawn)
U11  SHTC3  [FP-SHTC3-MFG]

### Blocks framed on the sheet
TESTPOINTS: TP27 TP33

### Ports
GND, TEMP_ENABLE (in), TEMP_I2C_SCL (in), TEMP_I2C_SDA (bidir), VIN_TEMP

### Nets
3V3_TEMP: R41.1 TP27.1(PAD) ; port VIN_TEMP  [project net 3V3]
GND: C51.1 R47.1 U11.4(VSS) ; port GND
TEMP_ENABLE: R47.2 TP33.1(PAD) U11.5(EP) ; port TEMP_ENABLE  [project net GPIO1]
TEMP_I2C_SCL: U11.2(SCL) ; port TEMP_I2C_SCL  [project net I2C_1_SCL]
TEMP_I2C_SDA: U11.3(SDA) ; port TEMP_I2C_SDA  [project net I2C_1_SDA]
NetC51_2: C51.2 R41.2 U11.1(VDD)

### Notes on the sheet
- I2C Pullups required above
- I2C Address = 0x70
- Jumper for Current Measurement
- Weak Pulldown to set default operation to Shutdown mode

### Library data of the parts
C51 = CMP-1034-02069-1: CAP 100nF 16V ±10% 0402 (1005 Metric) Thickness 0.6mm SMD; Case-EIA: 0402; Case-Metric: 1005; Tolerance: Â±10%; Value: 100nF; Max Thickness: 0.6 mm; Rated Voltage: 16 V; Technology: SMT
R41 = CMP-1013-00001-1: as R22 on sheet MAIN; Technology: SMT; Power: None
R47 = CMP-1011-00098-1: as R38 on sheet Speaker; Technology: SMT; Tolerance: 5 %; Power: 0.063 W
TP27 TP33 = 0.1" Pad-A.4
U11 = CMP-144040-000003-1: SENSOR HUMI/TEMP I2C 2% SMD; Manufacturer: Sensirion; Operating Supply Current: 0.3-900uA; Resolution: 16bits; Description: Humidity Temperature Sensor 0 ~ 100% RH I²C ±2% RH 8s Surface Mount; Min Supply Voltage: 1.62V; Max Supply Voltage: 3.6V; Category: IC; Device Class L3: unset; ComponentLink2URL: https://www.sensirion.com/fileadmin/user_upload/customers/sensirion/Dokumente/0_Datasheets/Humidity/Sensirion_Humidity_Sensors_SHTC3_Datasheet.pdf; Ipc Land Pattern Name: DFN200X200X75-4; RoHS: TRUE; Height: 0.75mm; Interface: I2C; Temperature Range High: +125°C; Accuracy: 2%; Sensor Output: I2C; Automotive: No; Package: 0; Device Class L1: Sensors; Manufacturer Part Number: SHTC3; Digikey Description: SENSOR HUMI/TEMP I2C 2% SMD; Lead Free: Yes; Temperature: -40°C to +125°C; Device Class L2: Temperature and Humidity Sensors; ComponentLink2Description: Datasheet; Octopart: https://octopart.com/shtc3-sensirion-91912225; Mouser Description: SHTC3 Series 0 to 100% RH 3.6 V Humidity and Temperature Sensor IC - DFN-4; Temperature Range Low: -40°C

## Sheet Accelerometer.SchDoc
size A
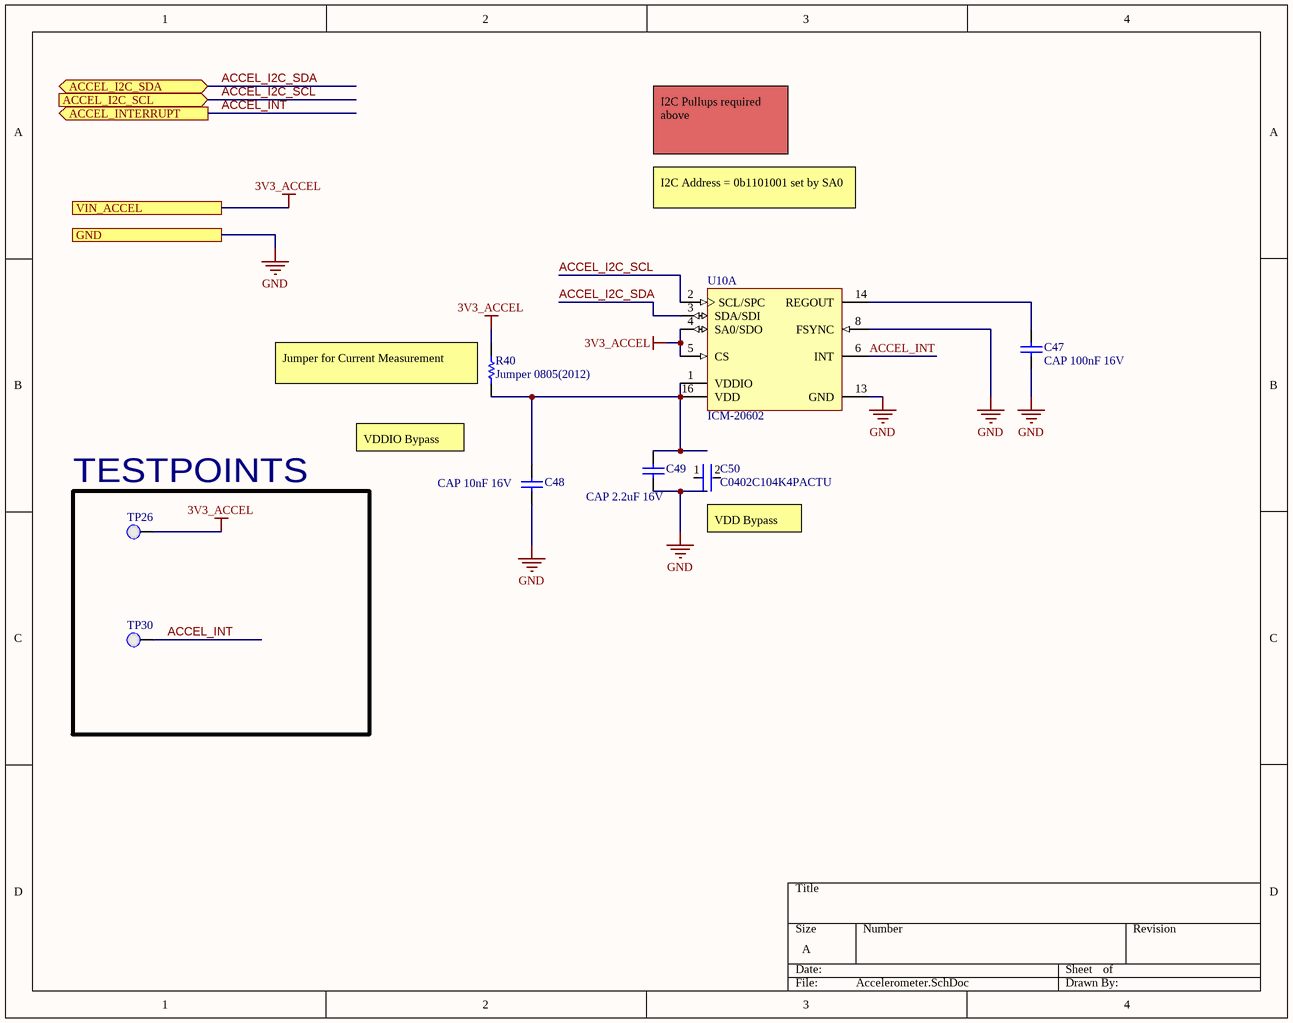
[diagram p7: Accelerometer.SchDoc]

### Parts
C47  CAP 100nF 16V  [CAPC0402(1005)60_M]
C48  CAP 10nF 16V  [CAPC0402(1005)33_L]
C49  CAP 2.2uF 16V  [CAPC0603(1608)100_L]
C50  C0402C104K4PACTU  [FP-C0402-BB-MFG]
R40  Jumper 0805(2012)  [RESC0805(2012)_N]
TP26  0.1" Pad  [PCBComponent]  (value not drawn)
TP30  0.1" Pad  [PCBComponent]  (value not drawn)
U10  ICM-20602  [INSE-I62-16]  (part A of 2)

### Blocks framed on the sheet
TESTPOINTS: TP26 TP30

### Ports
ACCEL_I2C_SCL (in), ACCEL_I2C_SDA (bidir), ACCEL_INTERRUPT (out), GND, VIN_ACCEL

### Nets
3V3_ACCEL: R40.1 TP26.1(PAD) U10.4(SA0/SDO) U10.5(CS) ; port VIN_ACCEL  [project net 3V3]
GND: C47.1 C48.1 C49.1 U10.8(FSYNC) U10.13(GND) ; port GND
ACCEL_I2C_SCL: U10.2(SCL/SPC) ; port ACCEL_I2C_SCL  [project net I2C_1_SCL]
ACCEL_I2C_SDA: U10.3(SDA/SDI) ; port ACCEL_I2C_SDA  [project net I2C_1_SDA]
ACCEL_INT: TP30.1(PAD) U10.6(INT) ; port ACCEL_INTERRUPT  [project net INTRP0]
NetC47_2: C47.2 U10.14(REGOUT)
NetC48_2: C48.2 C49.2 R40.2 U10.1(VDDIO) U10.16(VDD)

Not connected (* = marked no-connect by the designer): C50 1 2

### Notes on the sheet
- I2C Pullups required above
- I2C Address = 0b1101001 set by SA0
- (near R40) Jumper for Current Measurement
- VDDIO Bypass
- (near C50) VDD Bypass

### Library data of the parts
C47 = CMP-1034-02069-1: as C51 on sheet Temperature; Value: 100nF; Max Thickness: 0.6 mm; Rated Voltage: 16 V; Technology: SMT
C48 = CMP-1034-01875-1: CAP 10nF 16V ±10% 0402 (1005 Metric) Thickness 0.33mm SMD; Case-EIA: 0402; Tolerance: Â±10%; Case-Metric: 1005; Value: 10nF; Max Thickness: 0.33 mm; Rated Voltage: 16 V; Technology: SMT
C49 = CMP-1035-02763-1: CAP 2.2uF 16V ±10% 0603 (1608 Metric) Thickness 1mm SMD; Case-Metric: 1608; Case-EIA: 0603; Tolerance: Â±10%; Value: 2.2uF; Max Thickness: 1 mm; Technology: SMT; Rated Voltage: 16 V
C50 = CMP-1034-02069-4: CAP CER 0.1UF 16V 10% X5R 0402; Manufacturer: Kemet; Value: 0.10 μF; Tolerance: 0.1; Temperature Coefficient: 15%; Description: C0402 0.10 μF X5R 10.00% 16 V; Material: Ceramic; Package: C0402-BB; Lead Free: Yes; Manufacturer Part Number: C0402C104K4PACTU; Voltage Rating: 16 V; Temperature Characteristic: X5R; ComponentLink2URL: https://content.kemet.com/datasheets/KEM_C1002_X7R_SMD.pdf; ComponentLink2Description: Datasheet; Temperature Range Low: -55°C; Device Class L2: Capacitors; Octopart: https://octopart.com/c0402c104k4pactu-kemet-8375715; Device Class L1: Passive Components; Automotive: No; Height: 0.55mm; Mouser Description: Multilayer Ceramic Capacitors MLCC - SMD/SMT 16volts 0.1uF 10% X5R; Digikey Description: CAP CER 0.1UF 16V 10% X5R 0402; Temperature: -55°C to +125°C; Capacitance: 0.10 μF; Device Class L3: Ceramic Capacitors; Temperature Range High: +125°C; RoHS: TRUE; Category: Cap; Ipc Land Pattern Name: CAPC10050X50
R40 = CMP-1013-00001-1: as R22 on sheet MAIN; Technology: SMT; Power: None
TP26 TP30 = 0.1" Pad-A.4
U10 = CMP-2000-07589-1: High Performance 6-Axis MEMS MotionTracking(TM) Device, 1.71 to 3.45 V, -40 to 85 degC, 16-Pin LGA, RoHS; Manufacturer: InvenSense; Sensor Type: Temperature; Output Type: I2C; RoHSCompliant: True; Datasheet Version: Rev. 1.0, 10/2016; Datasheet URL: http://www.invensense.com/wp-content/uploads/2016/10/DS-000176-ICM-20602-v1.0.pdf; Min Operating Temperature: -40degC; Mounting Technology: SurfaceMount; Max Operating Temperature: 85degC; Manufacturer URL: http://www.invensense.com/; Package Reference: I62-16; Package Description: 16-Pin Land Grid Array, Body 3 x 3 mm, Pitch 0.5 mm

## Sheet Light.SchDoc
size A
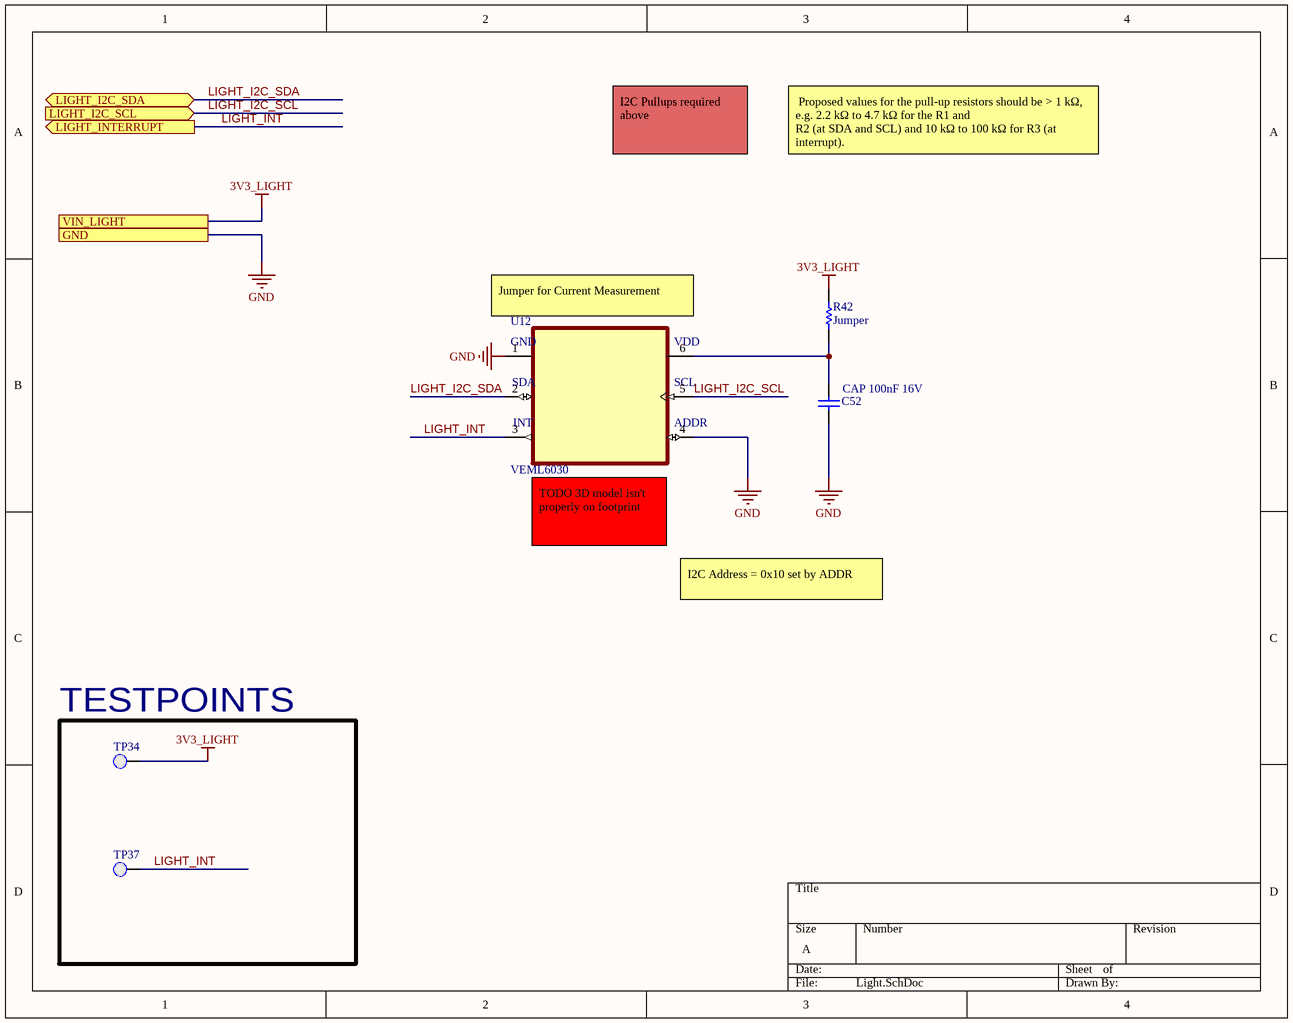
[diagram p8: Light.SchDoc]

### Parts
C52  CAP 100nF 16V  [CAPC0402(1005)60_M]
R42  Jumper  [RESC0805(2012)_N]
TP34  0.1" Pad  [PCBComponent]  (value not drawn)
TP37  0.1" Pad  [PCBComponent]  (value not drawn)
U12  VEML6030  [VISHAY_VEML6030_2X2X0.87]

### Blocks framed on the sheet
TESTPOINTS: TP34 TP37

### Ports
GND, LIGHT_I2C_SCL (in), LIGHT_I2C_SDA (bidir), LIGHT_INTERRUPT (out), VIN_LIGHT

### Nets
3V3_LIGHT: R42.1 TP34.1(PAD) ; port VIN_LIGHT  [project net 3V3]
GND: C52.1 U12.1(GND) U12.4(ADDR) ; port GND
LIGHT_I2C_SCL: U12.5(SCL) ; port LIGHT_I2C_SCL  [project net I2C_1_SCL]
LIGHT_I2C_SDA: U12.2(SDA) ; port LIGHT_I2C_SDA  [project net I2C_1_SDA]
LIGHT_INT: TP37.1(PAD) U12.3(INT) ; port LIGHT_INTERRUPT  [project net INTRP1]
NetC52_2: C52.2 R42.2 U12.6(VDD)

### Notes on the sheet
- I2C Pullups required above
- Proposed values for the pull-up resistors should be > 1 kΩ, e.g. 2.2 kΩ to 4.7 kΩ for the R1 and
  R2 (at SDA and SCL) and 10 kΩ to 100 kΩ for R3 (at interrupt).
- (near U12) Jumper for Current Measurement
- (near U12) TODO 3D model isn't properly on footprint
- I2C Address = 0x10 set by ADDR

### Library data of the parts
C52 = CMP-1034-02069-1: as C51 on sheet Temperature; Value: 100nF; Max Thickness: 0.6 mm; Rated Voltage: 16 V; Technology: SMT
R42 = CMP-1013-00001-1: as R22 on sheet MAIN; Technology: SMT; Power: None
TP34 TP37 = 0.1" Pad-A.4
U12 = VEML6030: Optical Sensor Ambient 550nm IÂ²C 6-SMD, No Lead; MF: Vishay; Value: *; Price: None; Package: SMD-6 Vishay; SnapEDA_Link: https://www.snapeda.com/parts/VEML6030/Vishay%20Semiconductor%20Opto%20Division/view-part/493148/?ref=snap; Availability: Unavailable; MP: VEML6030

## Sheet 3V3_BUCK.SchDoc
size A
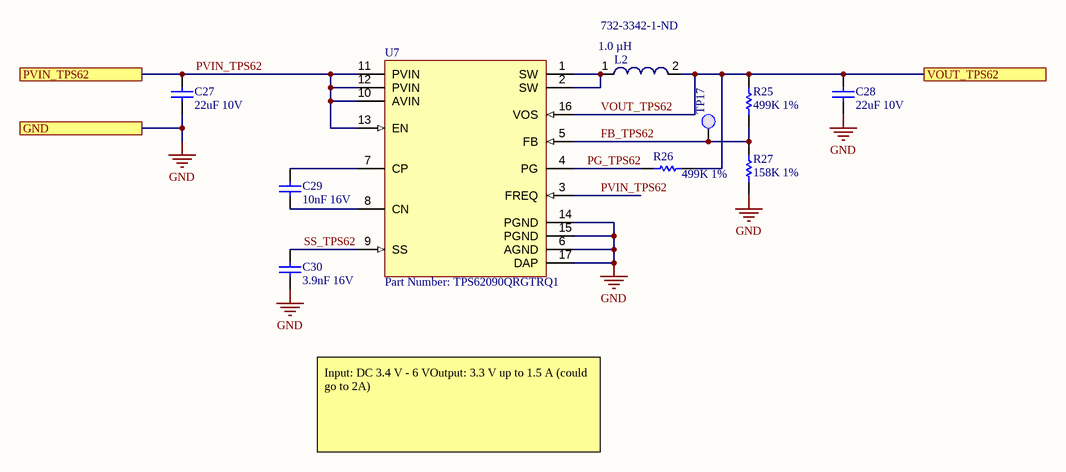
[diagram p9: 3V3_BUCK.SchDoc]

### Parts
C27  22uF 10V  [CAPC0805(2012)145_N]
C28  22uF 10V  [CAPC0805(2012)145_N]
C29  10nF 16V  [CAPC0603(1608)100_N]
C30  3.9nF 16V  [CAPC0603(1608)100_N]
L2  Inductance: 1.0 µH  Supplier Part Number 1: 732-3342-1-ND  [WE-LHMI 4020]  (hidden comment: 74437324010)
R25  499K 1%  [RESC0603(1608)_L]
R26  499K 1%  [RESC0603(1608)_L]
R27  158K 1%  [RESC0603(1608)_N]
TP17  0.1" Pad  [PCBComponent]  (value not drawn)
U7  Part Number: TPS62090QRGTRQ1  [QFN50P300X300X100_HS-17N]

### Ports
GND, PVIN_TPS62, VOUT_TPS62

### Nets
GND: C27.1 C28.1 C30.1 R27.1 U7.6(AGND) U7.14(PGND) U7.15(PGND) U7.17(DAP) ; port GND
FB_TPS62: R25.1 R27.2 TP17.1(PAD) U7.5(FB)
PG_TPS62: R26.2 U7.4(PG)
PVIN_TPS62: C27.2 U7.3(FREQ) U7.10(AVIN) U7.11(PVIN) U7.12(PVIN) U7.13(EN) ; port PVIN_TPS62
SS_TPS62: C30.2 U7.9(SS)
VOUT_TPS62: C28.2 L2.2 R25.2 R26.1 U7.16(VOS) ; port VOUT_TPS62
NetC29_1: C29.1 U7.8(CN)
NetC29_2: C29.2 U7.7(CP)
NetL2_1: L2.1 U7.1(SW) U7.2(SW)

### Notes on the sheet
- Input: DC 3.4 V - 6 VOutput: 3.3 V up to 1.5 A (could go to 2A)
- DWG. NO.
- REV.
- SHT.
- THIS DOCUMENT AND THE DATA DISCLOSED HEREIN OR HEREWITH IS THE PROPERTY OF ALTIUM LIMITED AND MAY BE FREELY DISTRIBUTED IN WHOLE. NO RIGHTS ARE RESERVED OR EXPRESS OR IMPLIED WARANTEE GIVEN.
- REVISION
- DESCRIPTION
- DATE
- APPROVED
- ENG:
- APPROVALS
- PROJECT
- DSN:
- CHK:
- REFERENCE DOCUMENTS
- PROJECT REVISION:
- TITLE
- DOCUMENT REVISION:
- DESIGN ITEM:
- BOM:
- FAB DWG:
- PCB DWG:
- ASSY DWG:
- SCALE:
- SIZE
- B
- CAGE CODE
- FILE NAME
- DWG NO.
- SHEET
- OF
- REV

### Library data of the parts
C27 C28 = CMP-1036-04943-1: as C17 on sheet 6v_BOOST; Rated Voltage: 10 V; Max Thickness: 1.45 mm; Technology: SMT; Value: 22uF
C29 = CMP-1035-02311-1: CAP 10nF 16V ±10% 0603 (1608 Metric) Thickness 1mm SMD; Case-EIA: 0603; Case-Metric: 1608; Tolerance: Â±10%; Rated Voltage: 16 V; Value: 10nF; Max Thickness: 1 mm; Technology: SMT
C30 = CMP-1035-02154-1: CAP 3.9nF 16V ±10% 0603 (1608 Metric) Thickness 1mm SMD; Tolerance: Â±10%; Case-Metric: 1608; Case-EIA: 0603; Max Thickness: 1 mm; Technology: SMT; Value: 3.9nF; Rated Voltage: 16 V
L2 = CMP-1353-00030-1: SMD Power Inductor WE-LHMI, L=1.0 µH; Manufacturer: Wuerth Elektronik; Core Material: Ferrite,Composite; Tolerance: 20%; Current Rating: 5A; Saturation Current: 9A; Shielding: Shielded; Frequency: 89MHz; DC Resistance (DCR): 27mR; Test Frequency: 100kHz; ComponentLink1Description: Manufacturer URL; ComponentLink2URL: http://katalog.we-online.de/kataloge/eisos/media/pdf/74437324010.pdf; PartNumber: 74437324010; ComponentLink1URL: http://www.we-online.com; ComponentLink2Description: Datasheet; PackageReference: WE-LHMI 4020; Supplier 1: Digi-Key; Manufacturer Part Number: 74437324010; Stock 1: 1150; Pricing 1: 1=2.20000, 10=2.15000, 50=1.97100, 100=1.88200, 500=1.79200, 1000=1.70200 (USD); RoHS: Yes; Mount: Surface Mount; Case/Package: Nonstandard; Min Operating Temperature: -40°C; Max Operating Temperature: 125°C; Package Quantity: 1; Packaging: Tape and Reel; Self Resonant Frequency: 89MHz; Inductance Tolerance: 20%; Composition: Wirewound; Max DC Current: 5A; Termination: SMD/SMT; RMS Current (Irms): 5A; Series Resistance: 27mR; Length: 4.45mm; Height: 1.8mm; Width: 4.06mm; Height - Seated (Max): 0.079inch; Depth: 4.06mm; REACH SVHC: Unknown; ComponentLink3URL: https://datasheet.ciiva.com/25608/0900766b810c01e4-25608161.pdf?src-supplier=RSComponents; ComponentLink3Description: https://datasheet.ciiva.com/25608/0900766b810c01e4-25608161.pdf?src-supplier=RSComponents; ComponentLink4URL: https://datasheet.ciiva.com/1052/74437324010-1052167.pdf?src-supplier=Digi-Key; ComponentLink4Description: https://datasheet.ciiva.com/1052/74437324010-1052167.pdf?src-supplier=Digi-Key; ComponentLink5URL: https://datasheet.ciiva.com/4961/74437324010-55268-4961274.pdf?src-supplier=Mouser; ComponentLink5Description: https://datasheet.ciiva.com/4961/74437324010-55268-4961274.pdf?src-supplier=Mouser; ComponentLink6URL: https://datasheet.ciiva.com/7892/1735821-7892716.pdf?src-supplier=Element14; ComponentLink6Description: https://datasheet.ciiva.com/7892/1735821-7892716.pdf?src-supplier=Element14; ComponentLink7URL: https://datasheet.ciiva.com/1052/74437324010-1052168.pdf?src-supplier=Digi-Key; ComponentLink7Description: https://datasheet.ciiva.com/1052/74437324010-1052168.pdf?src-supplier=Digi-Key; ComponentLink8URL: https://datasheet.ciiva.com/1052/74437324010-1052169.pdf?src-supplier=Digi-Key; ComponentLink8Description: https://datasheet.ciiva.com/1052/74437324010-1052169.pdf?src-supplier=Digi-Key
R25 R26 = CMP-1012-00815-1: 499K 0.1W 1% 0603 (1608 Metric)  SMD; Value: 499000.00 Ohm; Case-Metric: 1608; Case-EIA: 0603; Tolerance: 1 %; Technology: SMT; Power: 0.1 W
R27 = CMP-1012-00756-1: 158K 0.1W 1% 0603 (1608 Metric)  SMD; Value: 158000.00 Ohm; Case-Metric: 1608; Case-EIA: 0603; Tolerance: 1 %; Technology: SMT; Power: 0.1 W
TP17 = 0.1" Pad-A.4
U7 = TPS62090QRGTRQ1: No Description Available; Vendor: Texas Instruments; Built_By: Texas_Instrument_Team; CompType: IC; Manufacturer_Part_Number: TPS62090QRGTRQ1; Copyright: Copyright (C) 2018 Accelerated Designs. All rights reserved; RefDes: RefDes; Type: DEV; Value: Value; PartNumber: TPS62090QRGTRQ1; PackageReference: RGT0016C; MountType: SMT; RoHS: Y; Manufacturer: Texas Instruments